# EAGLE design expansionboard (EAGLE 7.5.0)

## Sheet 1 of 5: output interfaces
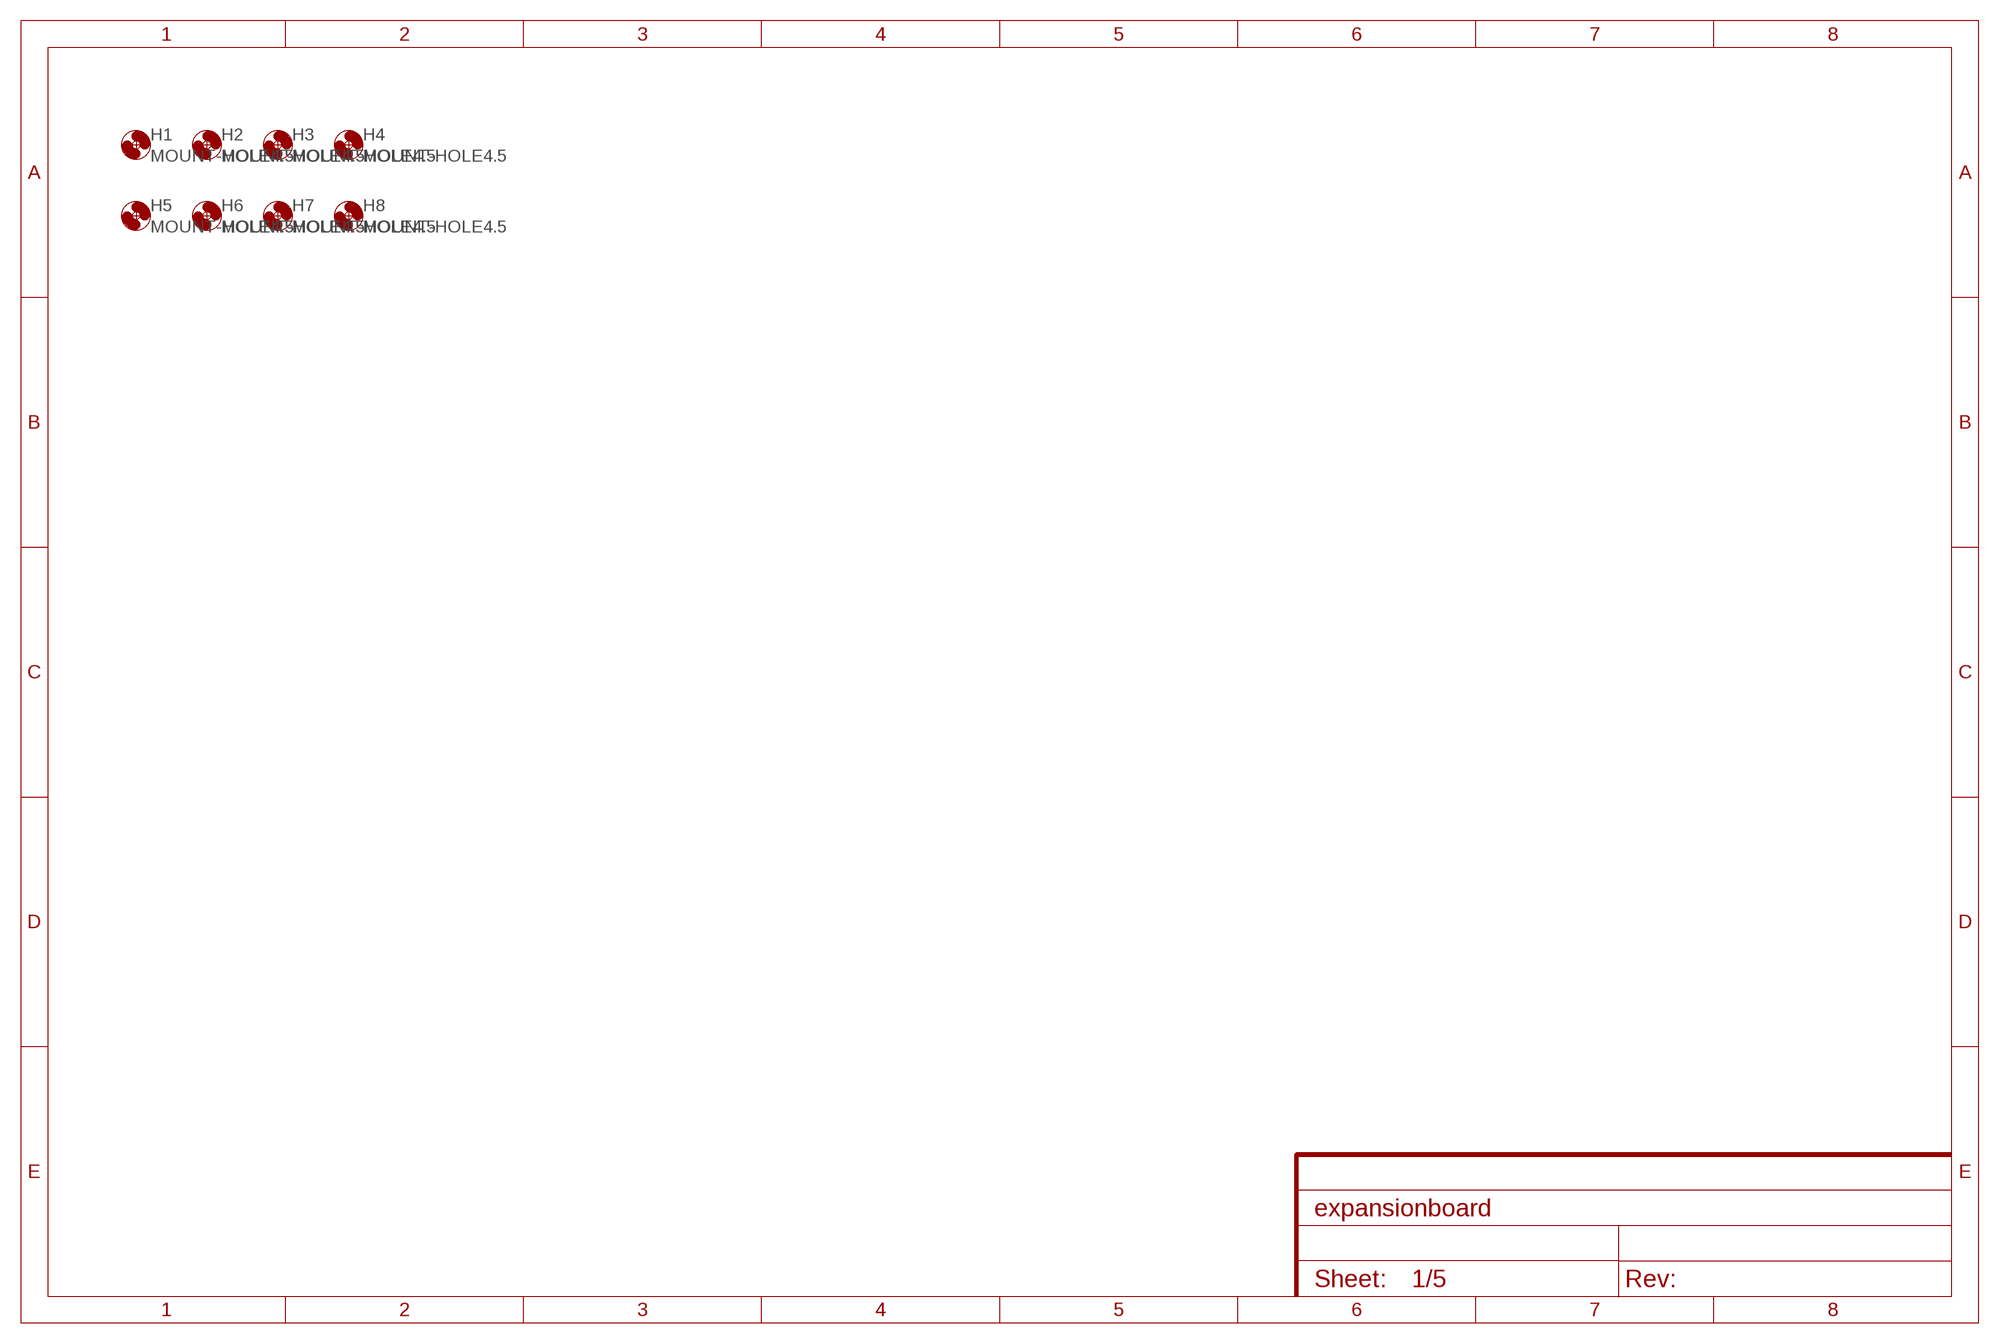
[diagram p0: schematic, sheet 1]

### Parts
H1  MOUNT-HOLE4.5  [4,5]
H2  MOUNT-HOLE4.5  [4,5]
H3  MOUNT-HOLE4.5  [4,5]
H4  MOUNT-HOLE4.5  [4,5]
H5  MOUNT-HOLE4.5  [4,5]
H6  MOUNT-HOLE4.5  [4,5]
H7  MOUNT-HOLE4.5  [4,5]
H8  MOUNT-HOLE4.5  [4,5]

## Sheet 2 of 5: Power Regulation
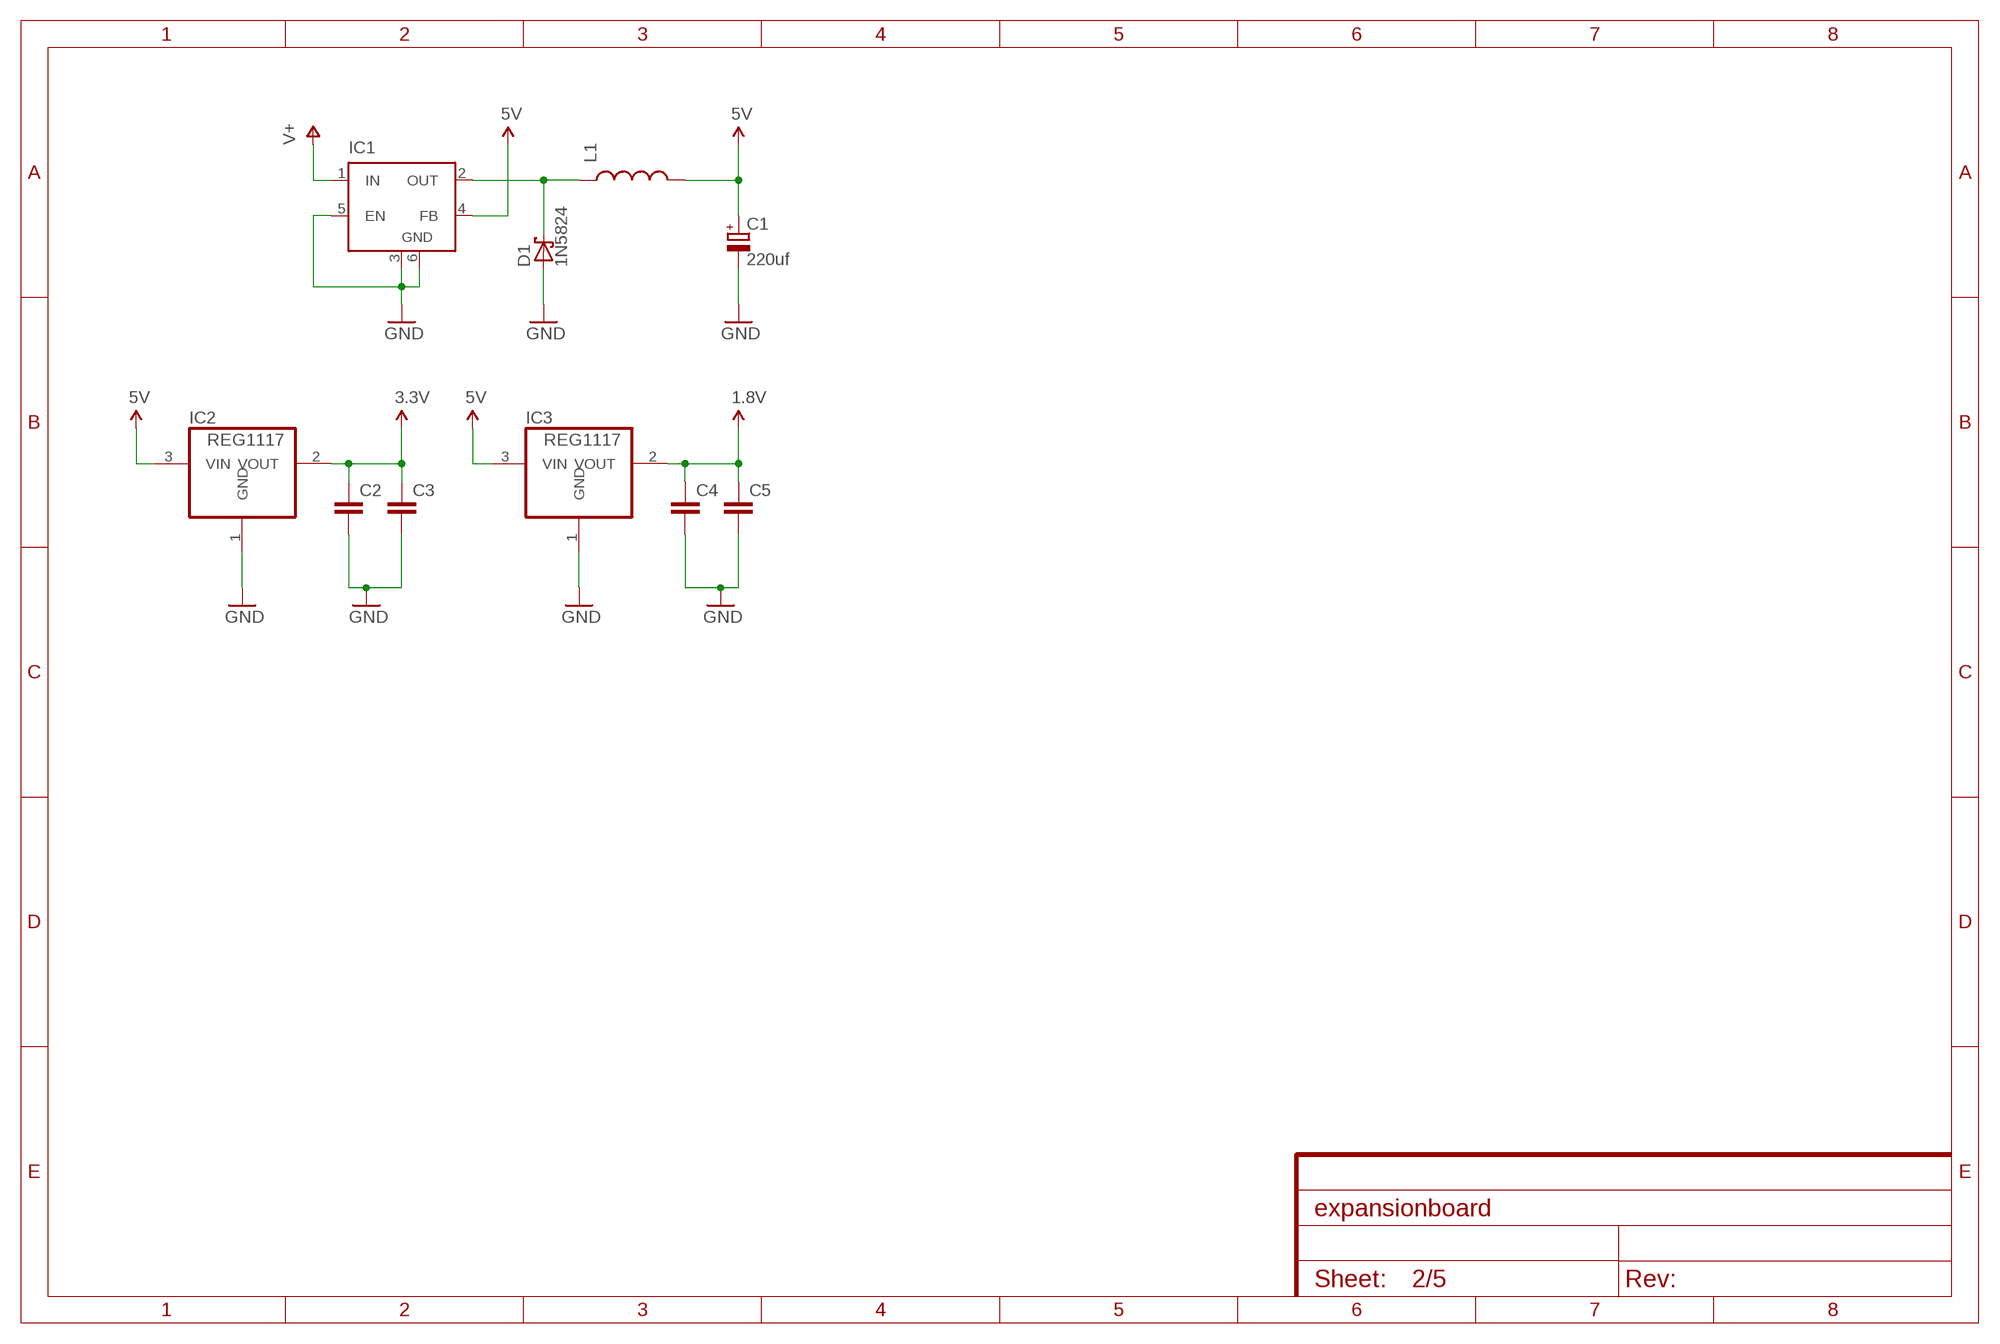
[diagram p1: schematic, sheet 2]

### Parts
C1  220uf  CPOL-EUE2.5-6  [E2,5-6]
C2  CAP1206  [1206]
C3  CAP1206  [1206]
C4  CAP1206  [1206]
C5  CAP1206  [1206]
D1  1N5824  1N5817-B  [DO41-7.6]
IC1  LM2596S  [TO263-5]
IC2  REG1117  [SOT223]
IC3  REG1117  [SOT223]
L1  INDUCTORSRU1038  [SRU1038]

### Nets
1.8V: C4.1 C5.1 IC3.2(VOUT)
3.3V: C2.1 C3.1 IC2.2(VOUT) ; also sheet 4
5V: C1.+ IC1.4(FB) IC2.3(VIN) IC3.3(VIN) L1.2 ; also sheet 5
GND: C1.- C2.2 C3.2 C4.2 C5.2 D1.A IC1.3(GND) IC1.5(EN) IC1.6(GND) IC2.1(GND) IC3.1(GND) ; also sheet 3,4,5
V+: IC1.1(IN) ; also sheet 3,5
VOUT: D1.C IC1.2(OUT) L1.1

## Sheet 3 of 5
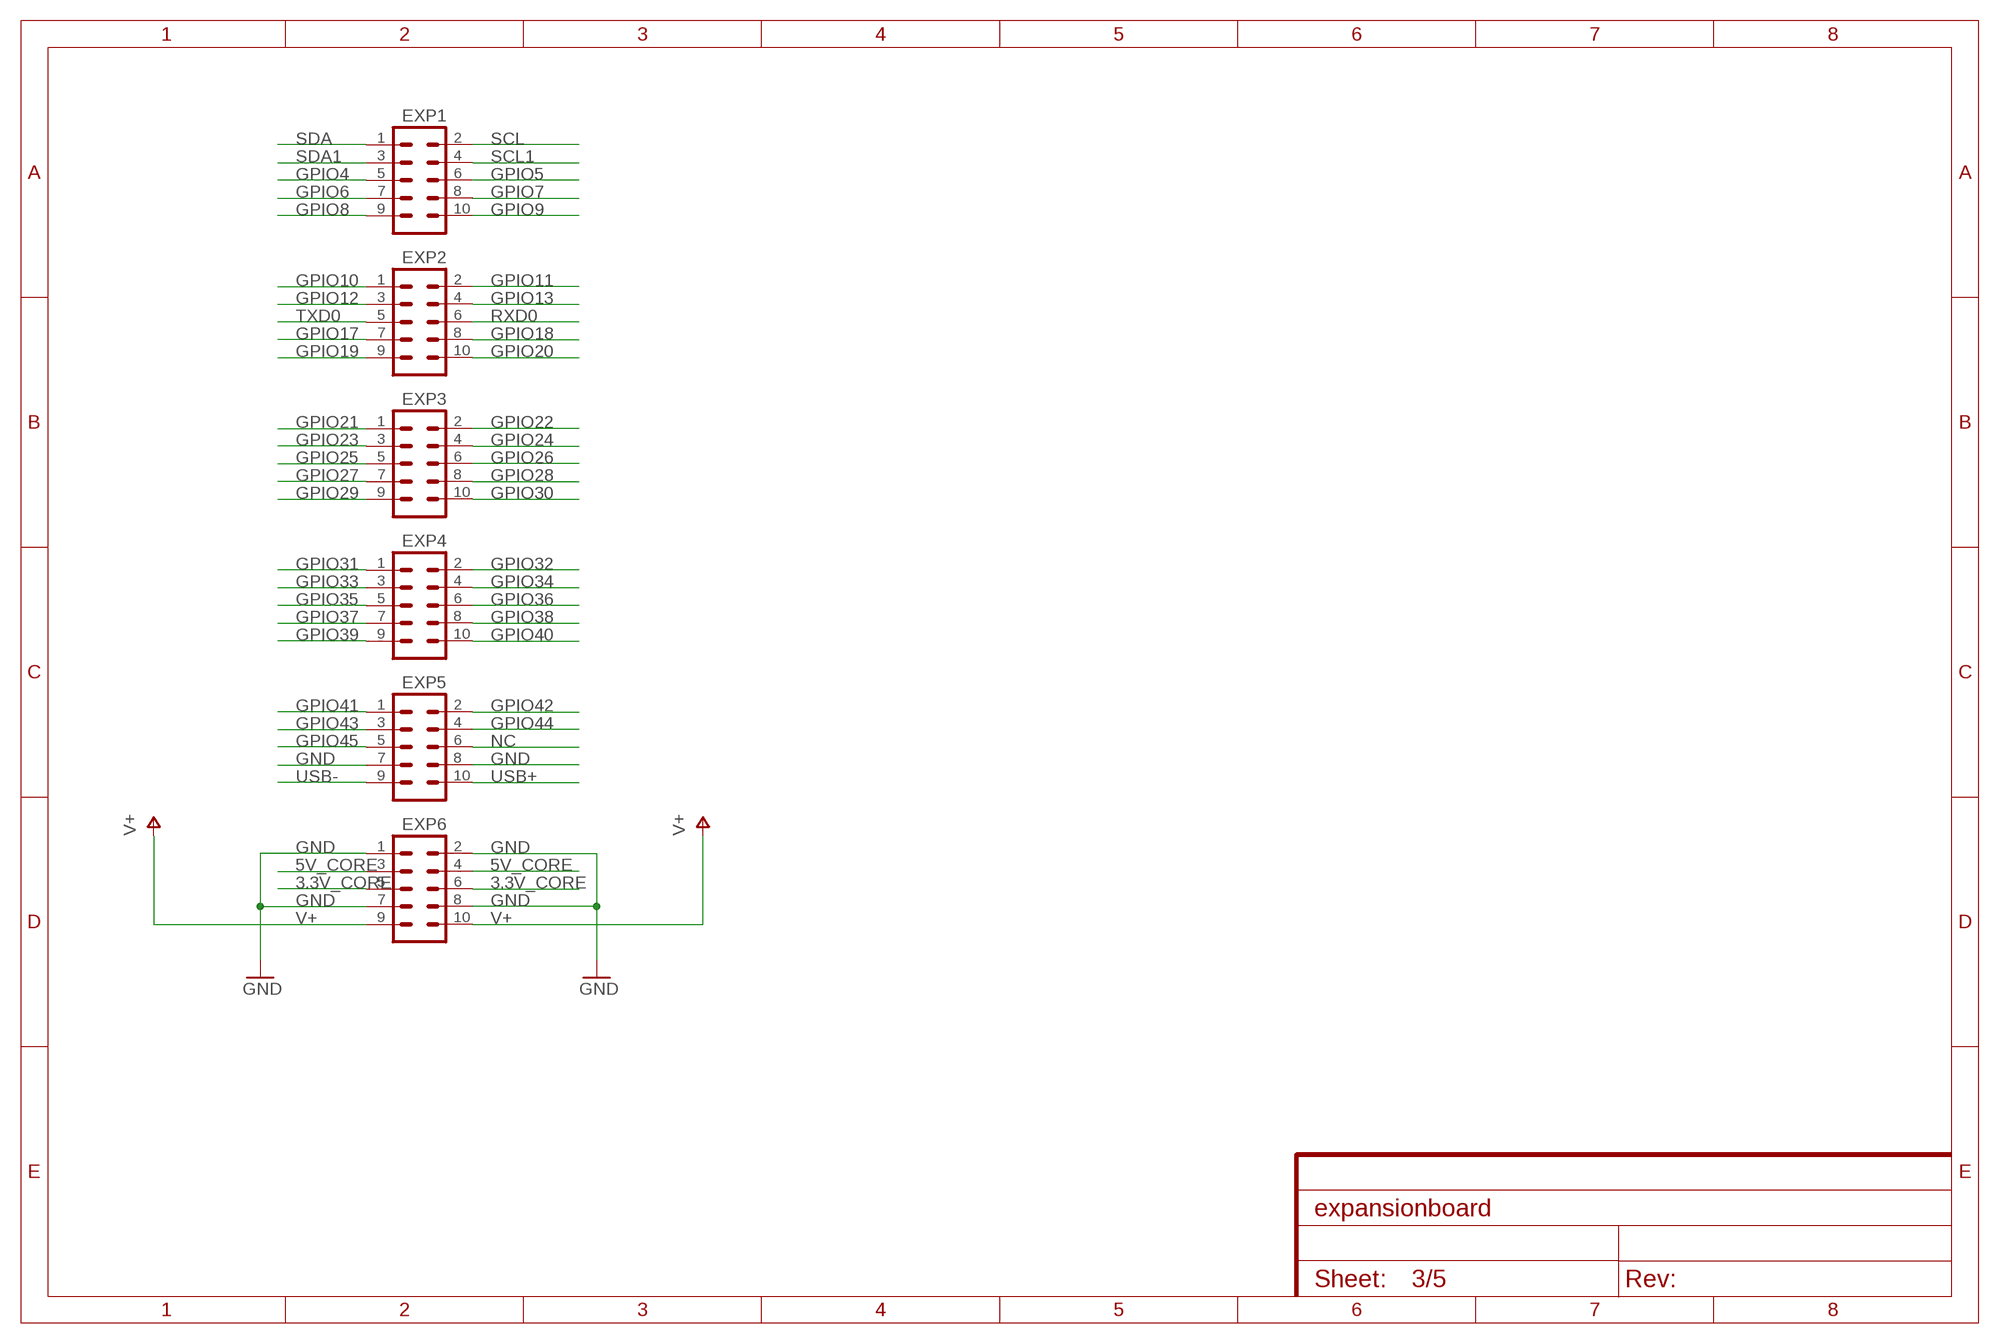
[diagram p2: schematic, sheet 3]

### Parts
EXP1  M05X2SHD_LOCK  [2X5-SHROUDED_LOCK]
EXP2  M05X2SHD_LOCK  [2X5-SHROUDED_LOCK]
EXP3  M05X2SHD_LOCK  [2X5-SHROUDED_LOCK]
EXP4  M05X2SHD_LOCK  [2X5-SHROUDED_LOCK]
EXP5  M05X2SHD_LOCK  [2X5-SHROUDED_LOCK]
EXP6  M05X2SHD_LOCK  [2X5-SHROUDED_LOCK]

### Nets
3.3V_CORE: EXP6.5 EXP6.6
5V_CORE: EXP6.3 EXP6.4
GND: EXP5.7 EXP5.8 EXP6.1 EXP6.2 EXP6.7 EXP6.8 ; also sheet 2,4,5
GPIO4: EXP1.5 ; also sheet 5
GPIO5: EXP1.6 ; also sheet 5
GPIO6: EXP1.7 ; also sheet 5
GPIO7: EXP1.8 ; also sheet 5
GPIO8: EXP1.9 ; also sheet 5
GPIO9: EXP1.10 ; also sheet 5
GPIO10: EXP2.1 ; also sheet 5
GPIO11: EXP2.2 ; also sheet 5
GPIO12: EXP2.3 ; also sheet 5
GPIO13: EXP2.4 ; also sheet 5
GPIO17: EXP2.7 ; also sheet 5
GPIO18: EXP2.8 ; also sheet 5
GPIO19: EXP2.9 ; also sheet 5
GPIO20: EXP2.10 ; also sheet 5
GPIO21: EXP3.1 ; also sheet 5
GPIO22: EXP3.2 ; also sheet 5
GPIO23: EXP3.3 ; also sheet 5
GPIO24: EXP3.4 ; also sheet 5
GPIO25: EXP3.5 ; also sheet 5
GPIO26: EXP3.6 ; also sheet 5
GPIO27: EXP3.7 ; also sheet 5
GPIO28: EXP3.8 ; also sheet 5
GPIO29: EXP3.9 ; also sheet 5
GPIO30: EXP3.10 ; also sheet 5
GPIO31: EXP4.1 ; also sheet 5
GPIO32: EXP4.2 ; also sheet 5
GPIO33: EXP4.3 ; also sheet 5
GPIO34: EXP4.4 ; also sheet 5
GPIO35: EXP4.5 ; also sheet 5
GPIO36: EXP4.6 ; also sheet 5
GPIO37: EXP4.7 ; also sheet 5
GPIO38: EXP4.8 ; also sheet 5
GPIO39: EXP4.9 ; also sheet 5
GPIO40: EXP4.10 ; also sheet 5
GPIO41: EXP5.1 ; also sheet 5
GPIO42: EXP5.2 ; also sheet 5
GPIO43: EXP5.3 ; also sheet 5
GPIO44: EXP5.4 ; also sheet 5
GPIO45: EXP5.5 ; also sheet 5
NC: EXP5.6
RXD0: EXP2.6 ; also sheet 5
SCL: EXP1.2 ; also sheet 5
SCL1: EXP1.4 ; also sheet 5
SDA: EXP1.1 ; also sheet 5
SDA1: EXP1.3 ; also sheet 5
TXD0: EXP2.5 ; also sheet 5
USB+: EXP5.10 ; also sheet 4
USB-: EXP5.9 ; also sheet 4
V+: EXP6.9 EXP6.10 ; also sheet 2,5

## Sheet 4 of 5
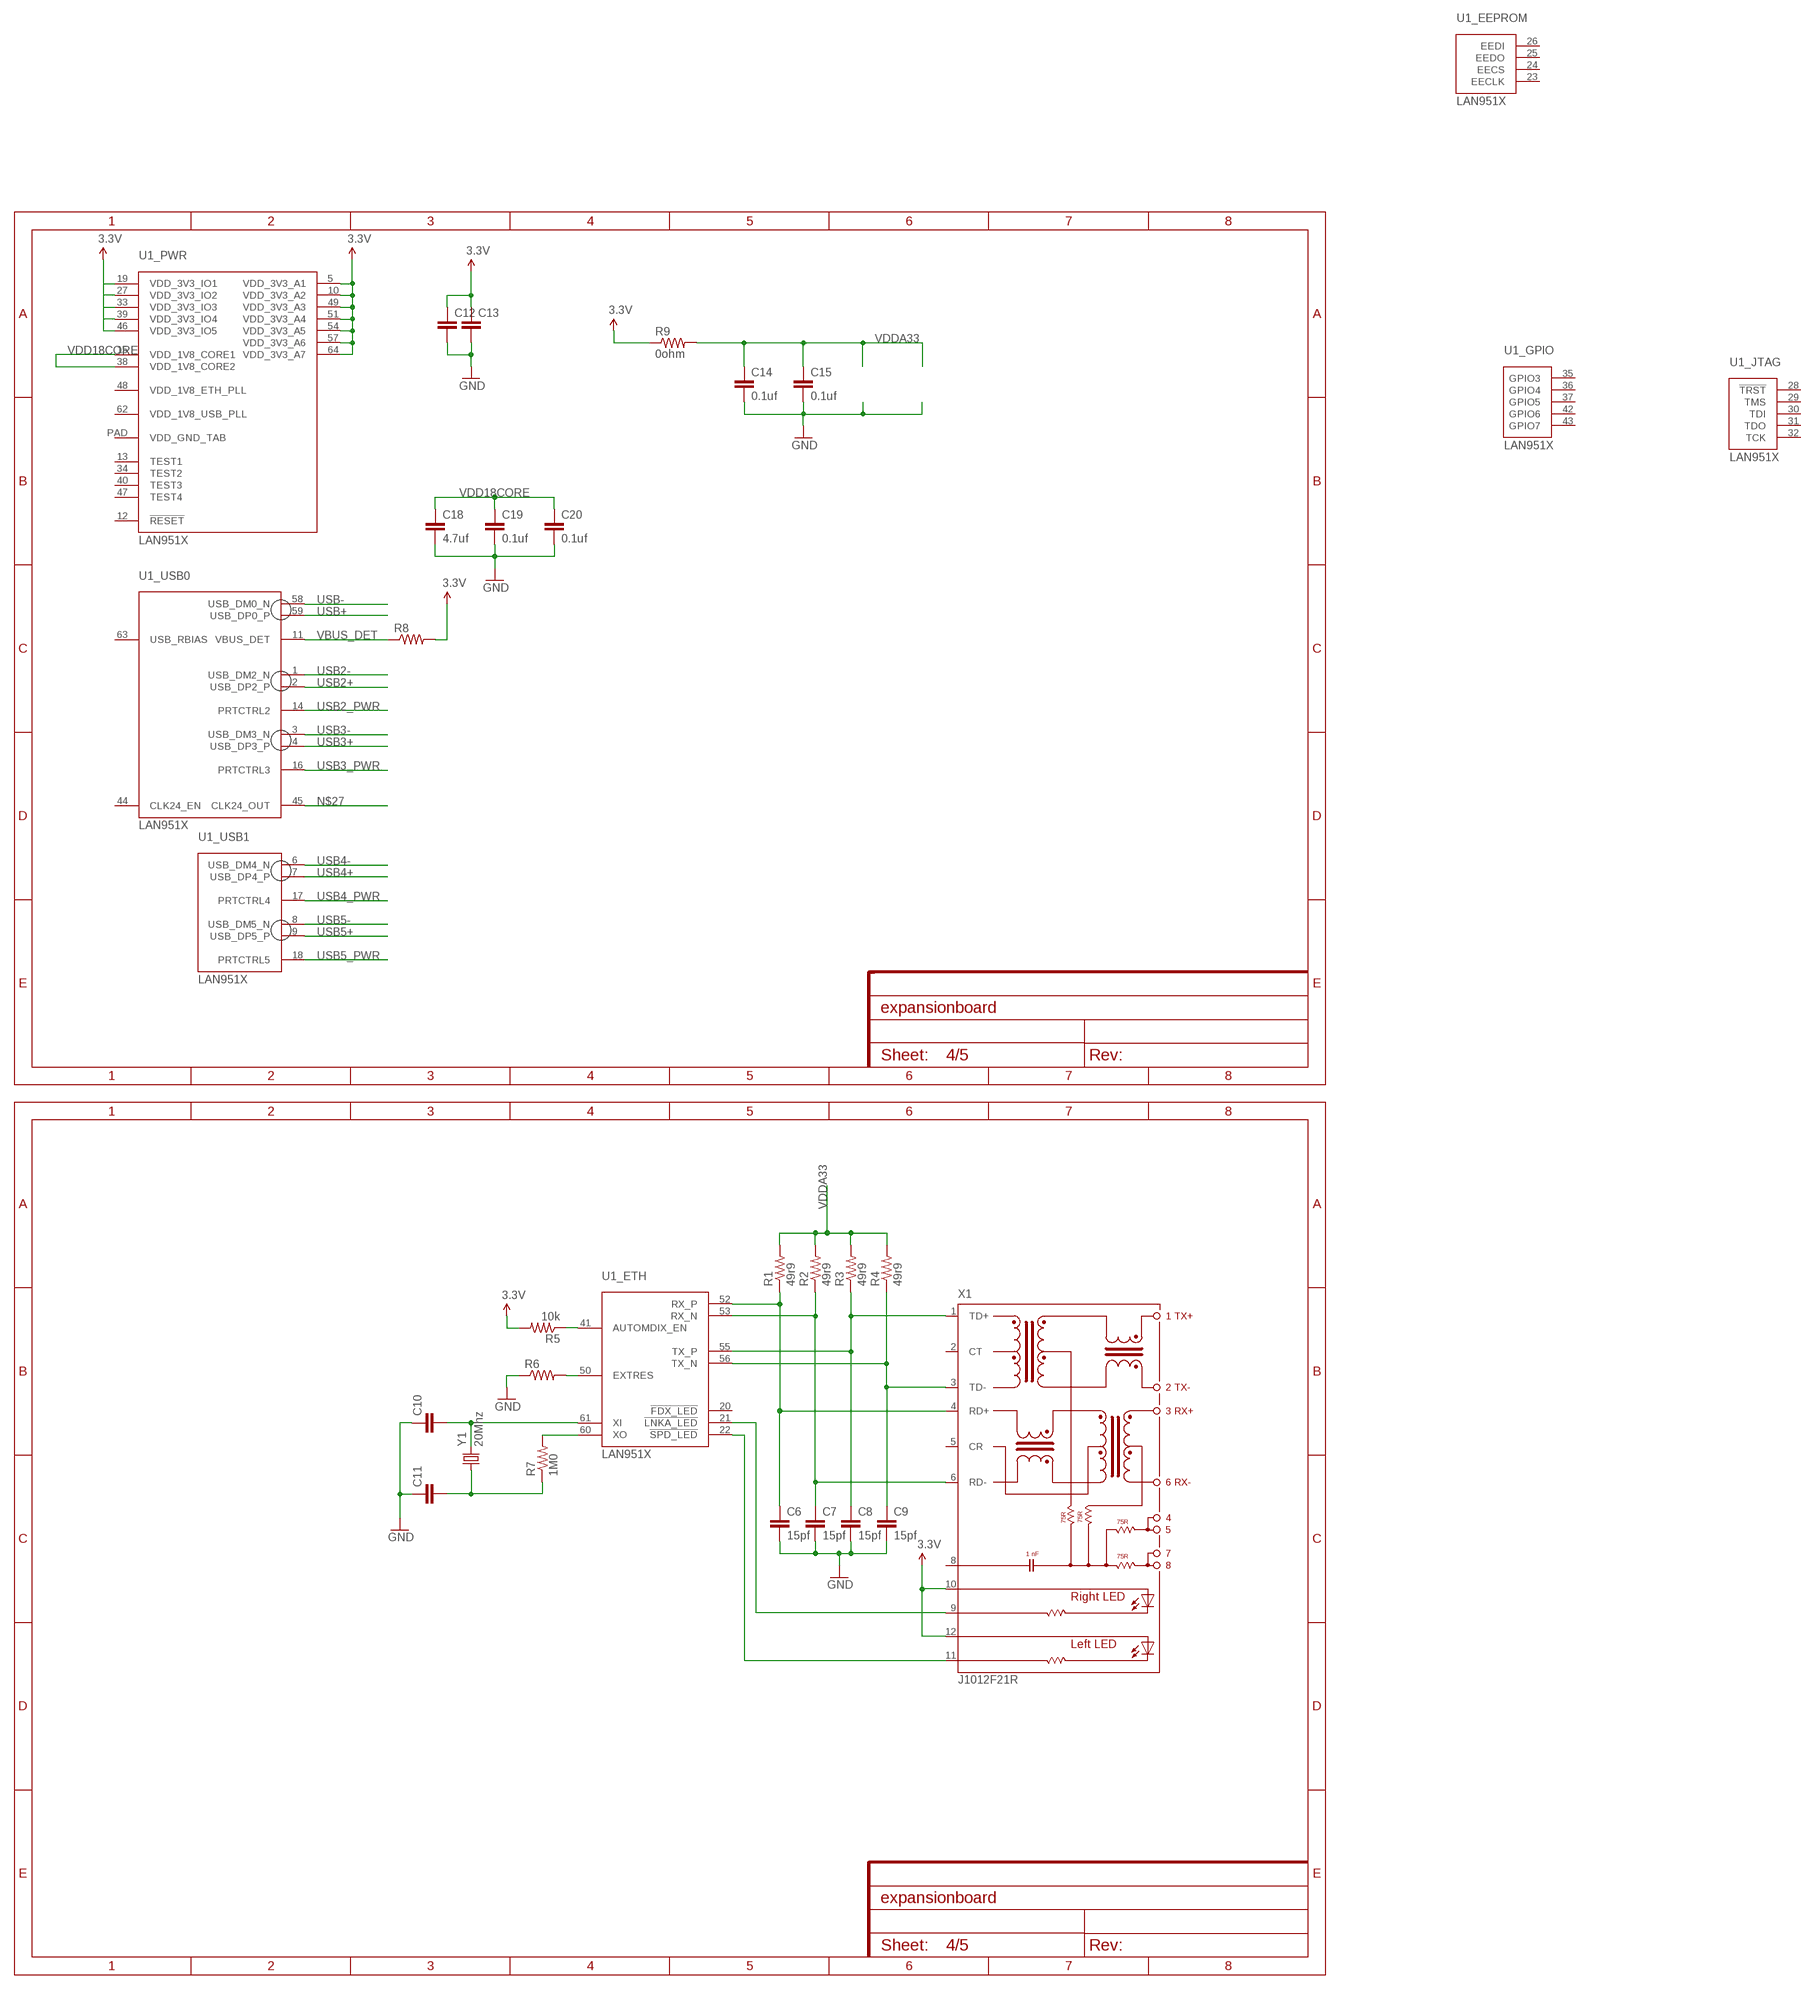
[diagram p3: schematic, sheet 4]

### Parts
C6  15pf  CAPEZ  [CAP-PTH-SMALLEZ]
C7  15pf  CAPEZ  [CAP-PTH-SMALLEZ]
C8  15pf  CAPEZ  [CAP-PTH-SMALLEZ]
C9  15pf  CAPEZ  [CAP-PTH-SMALLEZ]
C10  CAPEZ  [CAP-PTH-SMALLEZ]
C11  CAPEZ  [CAP-PTH-SMALLEZ]
C12  CAPEZ  [CAP-PTH-SMALLEZ]
C13  CAPEZ  [CAP-PTH-SMALLEZ]
C14  0.1uf  CAP1206  [1206]
C15  0.1uf  CAP1206  [1206]
C18  4.7uf  CAP1206  [1206]
C19  0.1uf  CAP1206  [1206]
C20  0.1uf  CAP1206  [1206]
R1  49r9  RESISTOREZ  [AXIAL-0.3EZ]
R2  49r9  RESISTOREZ  [AXIAL-0.3EZ]
R3  49r9  RESISTOREZ  [AXIAL-0.3EZ]
R4  49r9  RESISTOREZ  [AXIAL-0.3EZ]
R5  10k  RESISTOREZ  [AXIAL-0.3EZ]
R6  RESISTOREZ  [AXIAL-0.3EZ]
R7  1M0  RESISTOREZ  [AXIAL-0.3EZ]
R8  RESISTOR1206  [1206]
R9  0ohm  RESISTOR1206  [1206]
U1  LAN951X  [QFN-64]
X1  J1012F21R  [J1]
Y1  20Mhz  CRYSTALHC49US  [HC49US]

### Nets
3.3V: C12.1 C13.1 R5.P$2 R8.2 R9.1 U1.5(_PWR:VDD_3V3_A1) U1.10(_PWR:VDD_3V3_A2) U1.19(_PWR:VDD_3V3_IO1) U1.27(_PWR:VDD_3V3_IO2) U1.33(_PWR:VDD_3V3_IO3) U1.39(_PWR:VDD_3V3_IO4) U1.46(_PWR:VDD_3V3_IO5) U1.49(_PWR:VDD_3V3_A3) U1.51(_PWR:VDD_3V3_A4) U1.54(_PWR:VDD_3V3_A5) U1.57(_PWR:VDD_3V3_A6) U1.64(_PWR:VDD_3V3_A7) X1.10(A-R) X1.12(A-L) ; also sheet 2
GND: C6.2 C7.2 C8.2 C9.2 C10.1 C11.1 C12.2 C13.2 C14.2 C15.2 C18.2 C19.2 C20.2 R6.P$1 ; also sheet 2,3,5
N$1: C6.1 R1.P$1 U1.52(_ETH:RX_P) X1.4(RD+)
N$2: C7.1 R2.P$1 U1.53(_ETH:RX_N) X1.6(RD-)
N$3: C8.1 R3.P$1 U1.55(_ETH:TX_P) X1.1(TD+)
N$4: C9.1 R4.P$1 U1.56(_ETH:TX_N) X1.3(TD-)
N$7: U1.21(_ETH:!LNKA_LED) X1.9(C-R)
N$8: U1.22(_ETH:!SPD_LED) X1.11(C-L)
N$9: R5.P$1 U1.41(_ETH:AUTOMDIX_EN)
N$10: R6.P$2 U1.50(_ETH:EXTRES)
N$11: C10.2 U1.61(_ETH:XI) Y1.2
N$12: C11.2 R7.P$1 Y1.1
N$14: R7.P$2 U1.60(_ETH:XO)
N$27: U1.45(_USB0:CLK24_OUT)
USB2+: U1.2(_USB0:USB_DP2_P) ; also sheet 5
USB2-: U1.1(_USB0:USB_DM2_N) ; also sheet 5
USB2_PWR: U1.14(_USB0:PRTCTRL2) ; also sheet 5
USB3+: U1.4(_USB0:USB_DP3_P) ; also sheet 5
USB3-: U1.3(_USB0:USB_DM3_N) ; also sheet 5
USB3_PWR: U1.16(_USB0:PRTCTRL3) ; also sheet 5
USB4+: U1.7(_USB1:USB_DP4_P) ; also sheet 5
USB4-: U1.6(_USB1:USB_DM4_N) ; also sheet 5
USB4_PWR: U1.17(_USB1:PRTCTRL4) ; also sheet 5
USB5+: U1.9(_USB1:USB_DP5_P) ; also sheet 5
USB5-: U1.8(_USB1:USB_DM5_N) ; also sheet 5
USB5_PWR: U1.18(_USB1:PRTCTRL5) ; also sheet 5
USB+: U1.59(_USB0:USB_DP0_P) ; also sheet 3
USB-: U1.58(_USB0:USB_DM0_N) ; also sheet 3
VBUS_DET: R8.1 U1.11(_USB0:VBUS_DET)
VDD18CORE: C18.1 C19.1 C20.1 U1.15(_PWR:VDD_1V8_CORE1) U1.38(_PWR:VDD_1V8_CORE2)
VDDA33: C14.1 C15.1 R1.P$2 R2.P$2 R3.P$2 R4.P$2 R9.2
Unconnected: U1.12(_PWR:!RESET) U1.13(_PWR:TEST1) U1.20(_ETH:!FDX_LED) U1.23(_EEPROM:EECLK) U1.24(_EEPROM:EECS) U1.25(_EEPROM:EEDO) U1.26(_EEPROM:EEDI) U1.28(_JTAG:!TRST) U1.29(_JTAG:TMS) U1.30(_JTAG:TDI) U1.31(_JTAG:TDO) U1.32(_JTAG:TCK) U1.34(_PWR:TEST2) U1.35(_GPIO:GPIO3) U1.36(_GPIO:GPIO4) U1.37(_GPIO:GPIO5) U1.40(_PWR:TEST3) U1.42(_GPIO:GPIO6) U1.43(_GPIO:GPIO7) U1.44(_USB0:CLK24_EN) U1.47(_PWR:TEST4) U1.48(_PWR:VDD_1V8_ETH_PLL) U1.62(_PWR:VDD_1V8_USB_PLL) U1.63(_USB0:USB_RBIAS) U1.PAD(_PWR:VDD_GND_TAB) X1.2(CT) X1.5(CR) X1.8

## Sheet 5 of 5
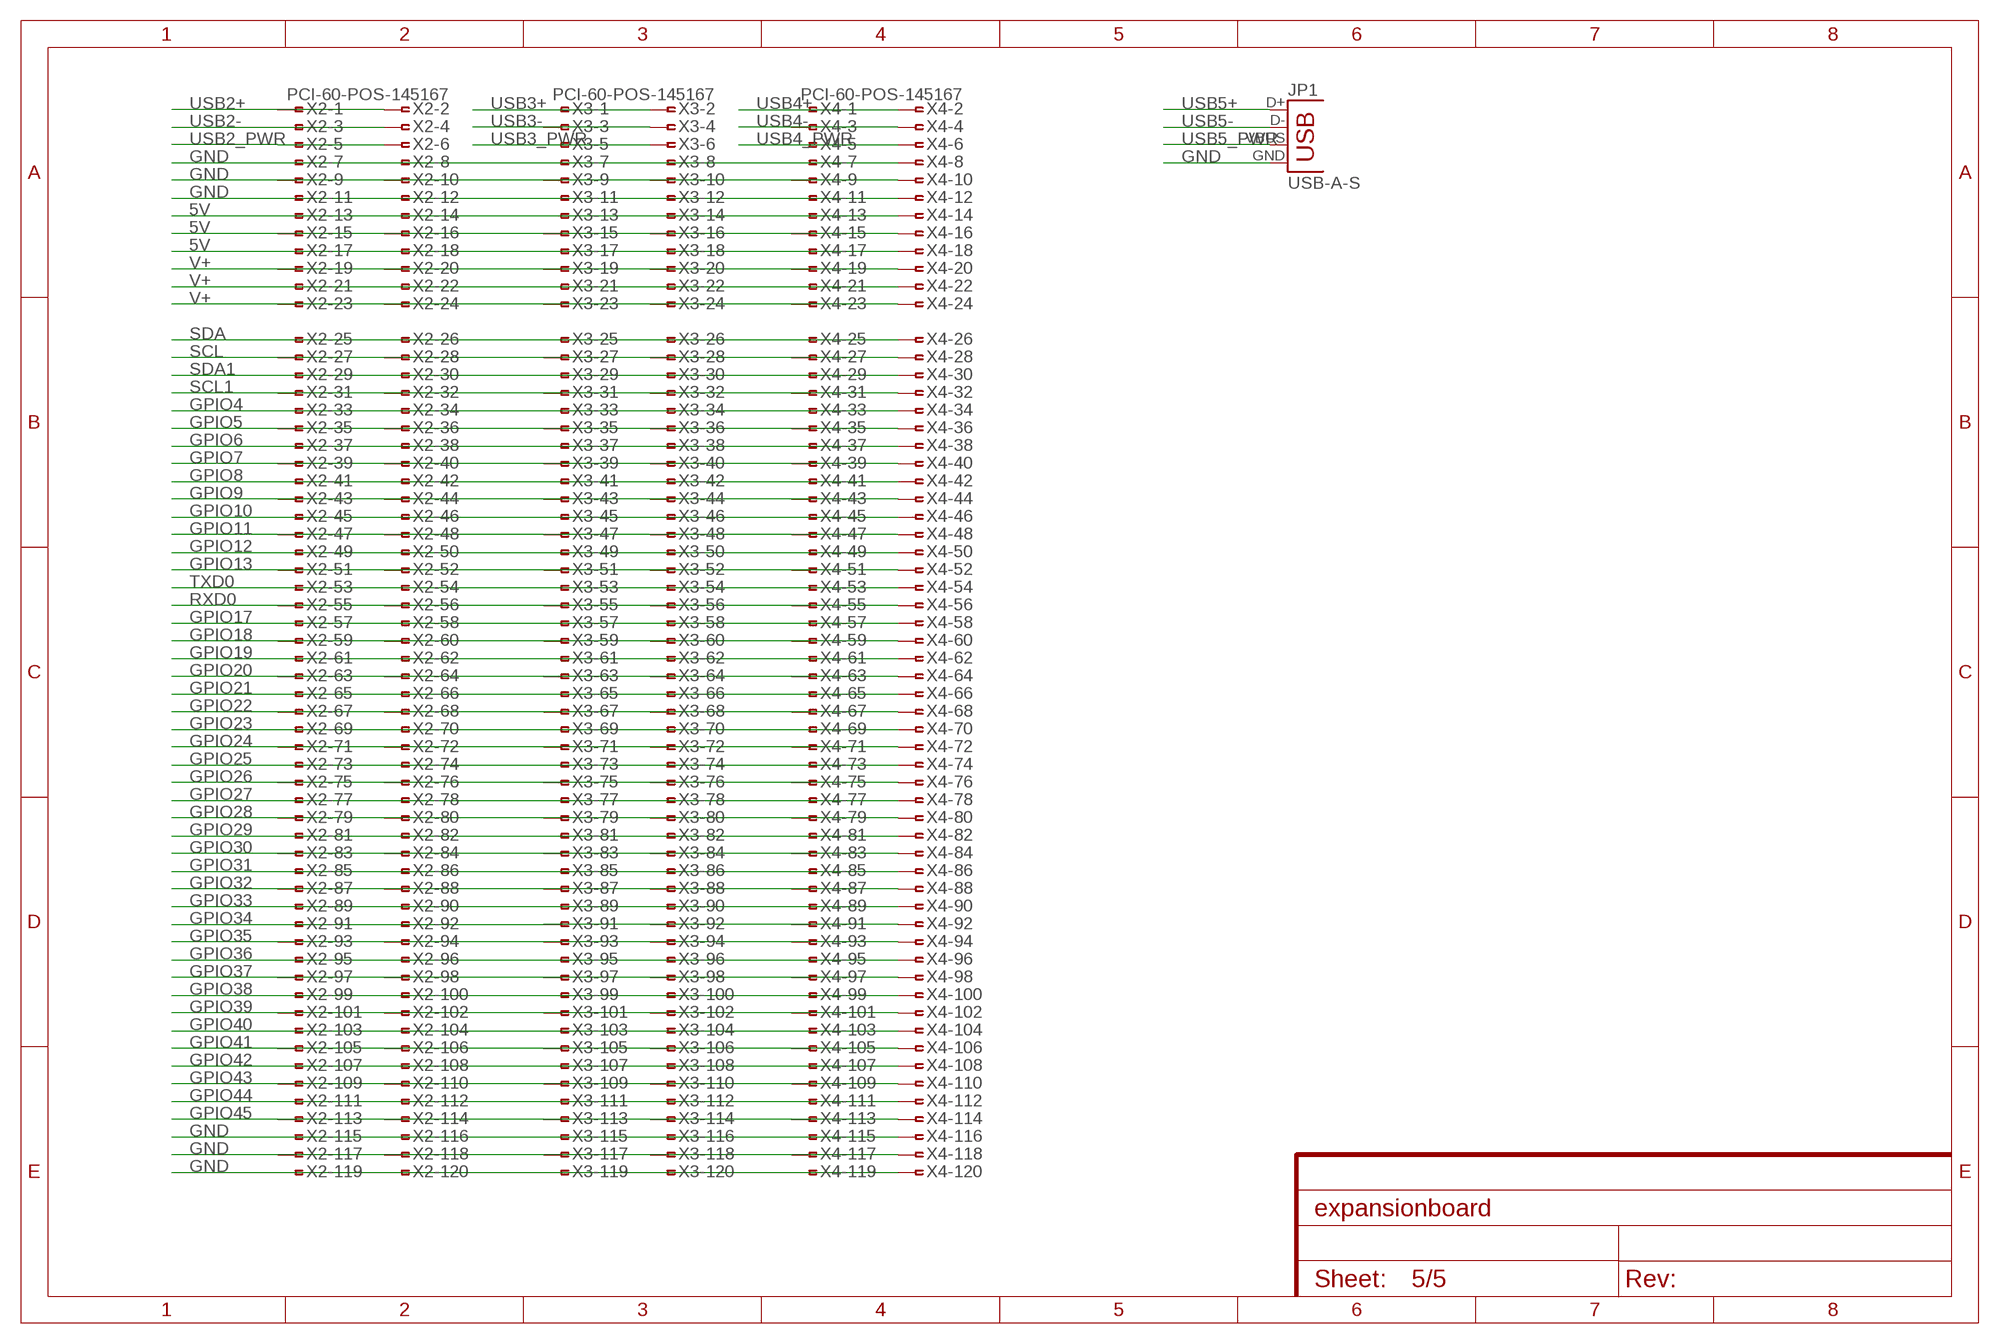
[diagram p4: schematic, sheet 5]

### Parts
JP1  USB-A-S  [USB-A-S]
X2  PCI-60-POS-145167  [145167-2]
X3  PCI-60-POS-145167  [145167-2]
X4  PCI-60-POS-145167  [145167-2]

### Nets
5V: X2.13 X2.14 X2.15 X2.16 X2.17 X2.18 X3.13 X3.14 X3.15 X3.16 X3.17 X3.18 X4.13 X4.14 X4.15 X4.16 X4.17 X4.18 ; also sheet 2
GND: JP1.GND X2.7 X2.8 X2.9 X2.10 X2.11 X2.12 X2.115 X2.116 X2.117 X2.118 X2.119 X2.120 X3.7 X3.8 X3.9 X3.10 X3.11 X3.12 X3.115 X3.116 X3.117 X3.118 X3.119 X3.120 X4.7 X4.8 X4.9 X4.10 X4.11 X4.12 X4.115 X4.116 X4.117 X4.118 X4.119 X4.120 ; also sheet 2,3,4
GPIO4: X2.33 X2.34 X3.33 X3.34 X4.33 X4.34 ; also sheet 3
GPIO5: X2.35 X2.36 X3.35 X3.36 X4.35 X4.36 ; also sheet 3
GPIO6: X2.37 X2.38 X3.37 X3.38 X4.37 X4.38 ; also sheet 3
GPIO7: X2.39 X2.40 X3.39 X3.40 X4.39 X4.40 ; also sheet 3
GPIO8: X2.41 X2.42 X3.41 X3.42 X4.41 X4.42 ; also sheet 3
GPIO9: X2.43 X2.44 X3.43 X3.44 X4.43 X4.44 ; also sheet 3
GPIO10: X2.45 X2.46 X3.45 X3.46 X4.45 X4.46 ; also sheet 3
GPIO11: X2.47 X2.48 X3.47 X3.48 X4.47 X4.48 ; also sheet 3
GPIO12: X2.49 X2.50 X3.49 X3.50 X4.49 X4.50 ; also sheet 3
GPIO13: X2.51 X2.52 X3.51 X3.52 X4.51 X4.52 ; also sheet 3
GPIO17: X2.57 X2.58 X3.57 X3.58 X4.57 X4.58 ; also sheet 3
GPIO18: X2.59 X2.60 X3.59 X3.60 X4.59 X4.60 ; also sheet 3
GPIO19: X2.61 X2.62 X3.61 X3.62 X4.61 X4.62 ; also sheet 3
GPIO20: X2.63 X2.64 X3.63 X3.64 X4.63 X4.64 ; also sheet 3
GPIO21: X2.65 X2.66 X3.65 X3.66 X4.65 X4.66 ; also sheet 3
GPIO22: X2.67 X2.68 X3.67 X3.68 X4.67 X4.68 ; also sheet 3
GPIO23: X2.69 X2.70 X3.69 X3.70 X4.69 X4.70 ; also sheet 3
GPIO24: X2.71 X2.72 X3.71 X3.72 X4.71 X4.72 ; also sheet 3
GPIO25: X2.73 X2.74 X3.73 X3.74 X4.73 X4.74 ; also sheet 3
GPIO26: X2.75 X2.76 X3.75 X3.76 X4.75 X4.76 ; also sheet 3
GPIO27: X2.77 X2.78 X3.77 X3.78 X4.77 X4.78 ; also sheet 3
GPIO28: X2.79 X2.80 X3.79 X3.80 X4.79 X4.80 ; also sheet 3
GPIO29: X2.81 X2.82 X3.81 X3.82 X4.81 X4.82 ; also sheet 3
GPIO30: X2.83 X2.84 X3.83 X3.84 X4.83 X4.84 ; also sheet 3
GPIO31: X2.85 X2.86 X3.85 X3.86 X4.85 X4.86 ; also sheet 3
GPIO32: X2.87 X2.88 X3.87 X3.88 X4.87 X4.88 ; also sheet 3
GPIO33: X2.89 X2.90 X3.89 X3.90 X4.89 X4.90 ; also sheet 3
GPIO34: X2.91 X2.92 X3.91 X3.92 X4.91 X4.92 ; also sheet 3
GPIO35: X2.93 X2.94 X3.93 X3.94 X4.93 X4.94 ; also sheet 3
GPIO36: X2.95 X2.96 X3.95 X3.96 X4.95 X4.96 ; also sheet 3
GPIO37: X2.97 X2.98 X3.97 X3.98 X4.97 X4.98 ; also sheet 3
GPIO38: X2.99 X2.100 X3.99 X3.100 X4.99 X4.100 ; also sheet 3
GPIO39: X2.101 X2.102 X3.101 X3.102 X4.101 X4.102 ; also sheet 3
GPIO40: X2.103 X2.104 X3.103 X3.104 X4.103 X4.104 ; also sheet 3
GPIO41: X2.105 X2.106 X3.105 X3.106 X4.105 X4.106 ; also sheet 3
GPIO42: X2.107 X2.108 X3.107 X3.108 X4.107 X4.108 ; also sheet 3
GPIO43: X2.109 X2.110 X3.109 X3.110 X4.109 X4.110 ; also sheet 3
GPIO44: X2.111 X2.112 X3.111 X3.112 X4.111 X4.112 ; also sheet 3
GPIO45: X2.113 X2.114 X3.113 X3.114 X4.113 X4.114 ; also sheet 3
RXD0: X2.55 X2.56 X3.55 X3.56 X4.55 X4.56 ; also sheet 3
SCL: X2.27 X2.28 X3.27 X3.28 X4.27 X4.28 ; also sheet 3
SCL1: X2.31 X2.32 X3.31 X3.32 X4.31 X4.32 ; also sheet 3
SDA: X2.25 X2.26 X3.25 X3.26 X4.25 X4.26 ; also sheet 3
SDA1: X2.29 X2.30 X3.29 X3.30 X4.29 X4.30 ; also sheet 3
TXD0: X2.53 X2.54 X3.53 X3.54 X4.53 X4.54 ; also sheet 3
USB2+: X2.1 X2.2 ; also sheet 4
USB2-: X2.3 X2.4 ; also sheet 4
USB2_PWR: X2.5 X2.6 ; also sheet 4
USB3+: X3.1 X3.2 ; also sheet 4
USB3-: X3.3 X3.4 ; also sheet 4
USB3_PWR: X3.5 X3.6 ; also sheet 4
USB4+: X4.1 X4.2 ; also sheet 4
USB4-: X4.3 X4.4 ; also sheet 4
USB4_PWR: X4.5 X4.6 ; also sheet 4
USB5+: JP1.D+ ; also sheet 4
USB5-: JP1.D- ; also sheet 4
USB5_PWR: JP1.VBUS ; also sheet 4
V+: X2.19 X2.20 X2.21 X2.22 X2.23 X2.24 X3.19 X3.20 X3.21 X3.22 X3.23 X3.24 X4.19 X4.20 X4.21 X4.22 X4.23 X4.24 ; also sheet 2,3

## Library data of the parts
C1 = rcl:CPOL-EU: POLARIZED CAPACITOR, European symbol
C2-C15 C18-C20 = SparkFun-Capacitors:CAP: Capacitor Standard 0603 ceramic capacitor, and 0.1" leaded capacitor.
D1 = diode:1N581*: 1.0A SCHOTTKY BARRIER RECTIFIER Source: http://www.diodes.com/datasheets/ds23001.pdf
EXP1-EXP6 = SparkFun-Connectors:M05X2: Header 5x2 Standard 10-pin dual row 0.1" header. Commonly used with AVR-ISP. Use with Spark Fun Electronics SKU: PRT-00778
H1-H8 = holes:MOUNT-HOLE: MOUNTING HOLE with drill center marker
IC1 = linear:LM2596S: STEP-DOWN VOLTAGE REGULATOR
IC2 IC3 = burr-brown:REG1117: 800mA and 1A Low Dropout (LDO) Positive Regulator 1.8V, 2.5V, 2.85V, 3.3V, 5V, and Adj; MPN: REG1117; OC_FARNELL: 1097566; OC_NEWARK: 14P6981
JP1 = SparkFun-Connectors:USB: USB Connectors USB-B-PTH is fully proven SKU : PRT-00139/CONN-08278 USB-miniB is fully proven SKU : PRT-00587 USB-A-PCB is untested. USB-A-H is throughly reviewed, but untested. Spark Fun Electronics SKU : PRT-00437 USB-B-SMT is throughly reviewed, but untested. Needs silkscreen touching up. USB-A-S has not been used/tested USB-MB-H has not been used/tested USB-MICROB has been used. CONN-09505
L1 = SparkFun-Passives:INDUCTOR: Inductors Basic Inductor/Choke - 0603 and 1206. Footprints are not proven and vary greatly between part numbers. SRN6045- 33uH, 20% 1.4A SDR0403-560KL - 56uH, 10%, 500mA RMS/740mA peak
R1-R9 = SparkFun-Resistors:RESISTOR: Resistor Basic schematic elements and footprints for 0603, 1206, and PTH resistors.
U1 = Ciseco%20Pi%20Compute%20Module:LAN951X: LAN951X LAN9512 has two downstream USB ports LAN9514 has four downstream USB ports The same footprint is use for both but for LAN9512 (2 port) accpications the _USB1 block signals should be NC
X1 = con-pulse:J1012F21R: PULSEJACK (TM) 1x1 Tab-UP RJ45 10/100 Base-TX RJ45 1x1 Tab-UP with LEDs 8-pin (J1 series) and 6-pin (JP series) integrated magnetics connector, designed to support applications, such as ADSL modems, LAN-on-Motherboard, and Hub and Switches. Source: www.pulseeng.com .. PulseJack-J402.pdf; OC_FARNELL: unknown; OC_NEWARK: unknown
X2-X4 = con-amp:PCI-60-POS: PCI-SLOT 60 Dual Position 0.05 Series Standard Edge Source: http://catalog.tycoelectronics.com .. ENG_CD_145167_F.pdf
Y1 = SparkFun-FreqCtrl:CRYSTAL: Various standard crystals. Proven footprints.

## Board
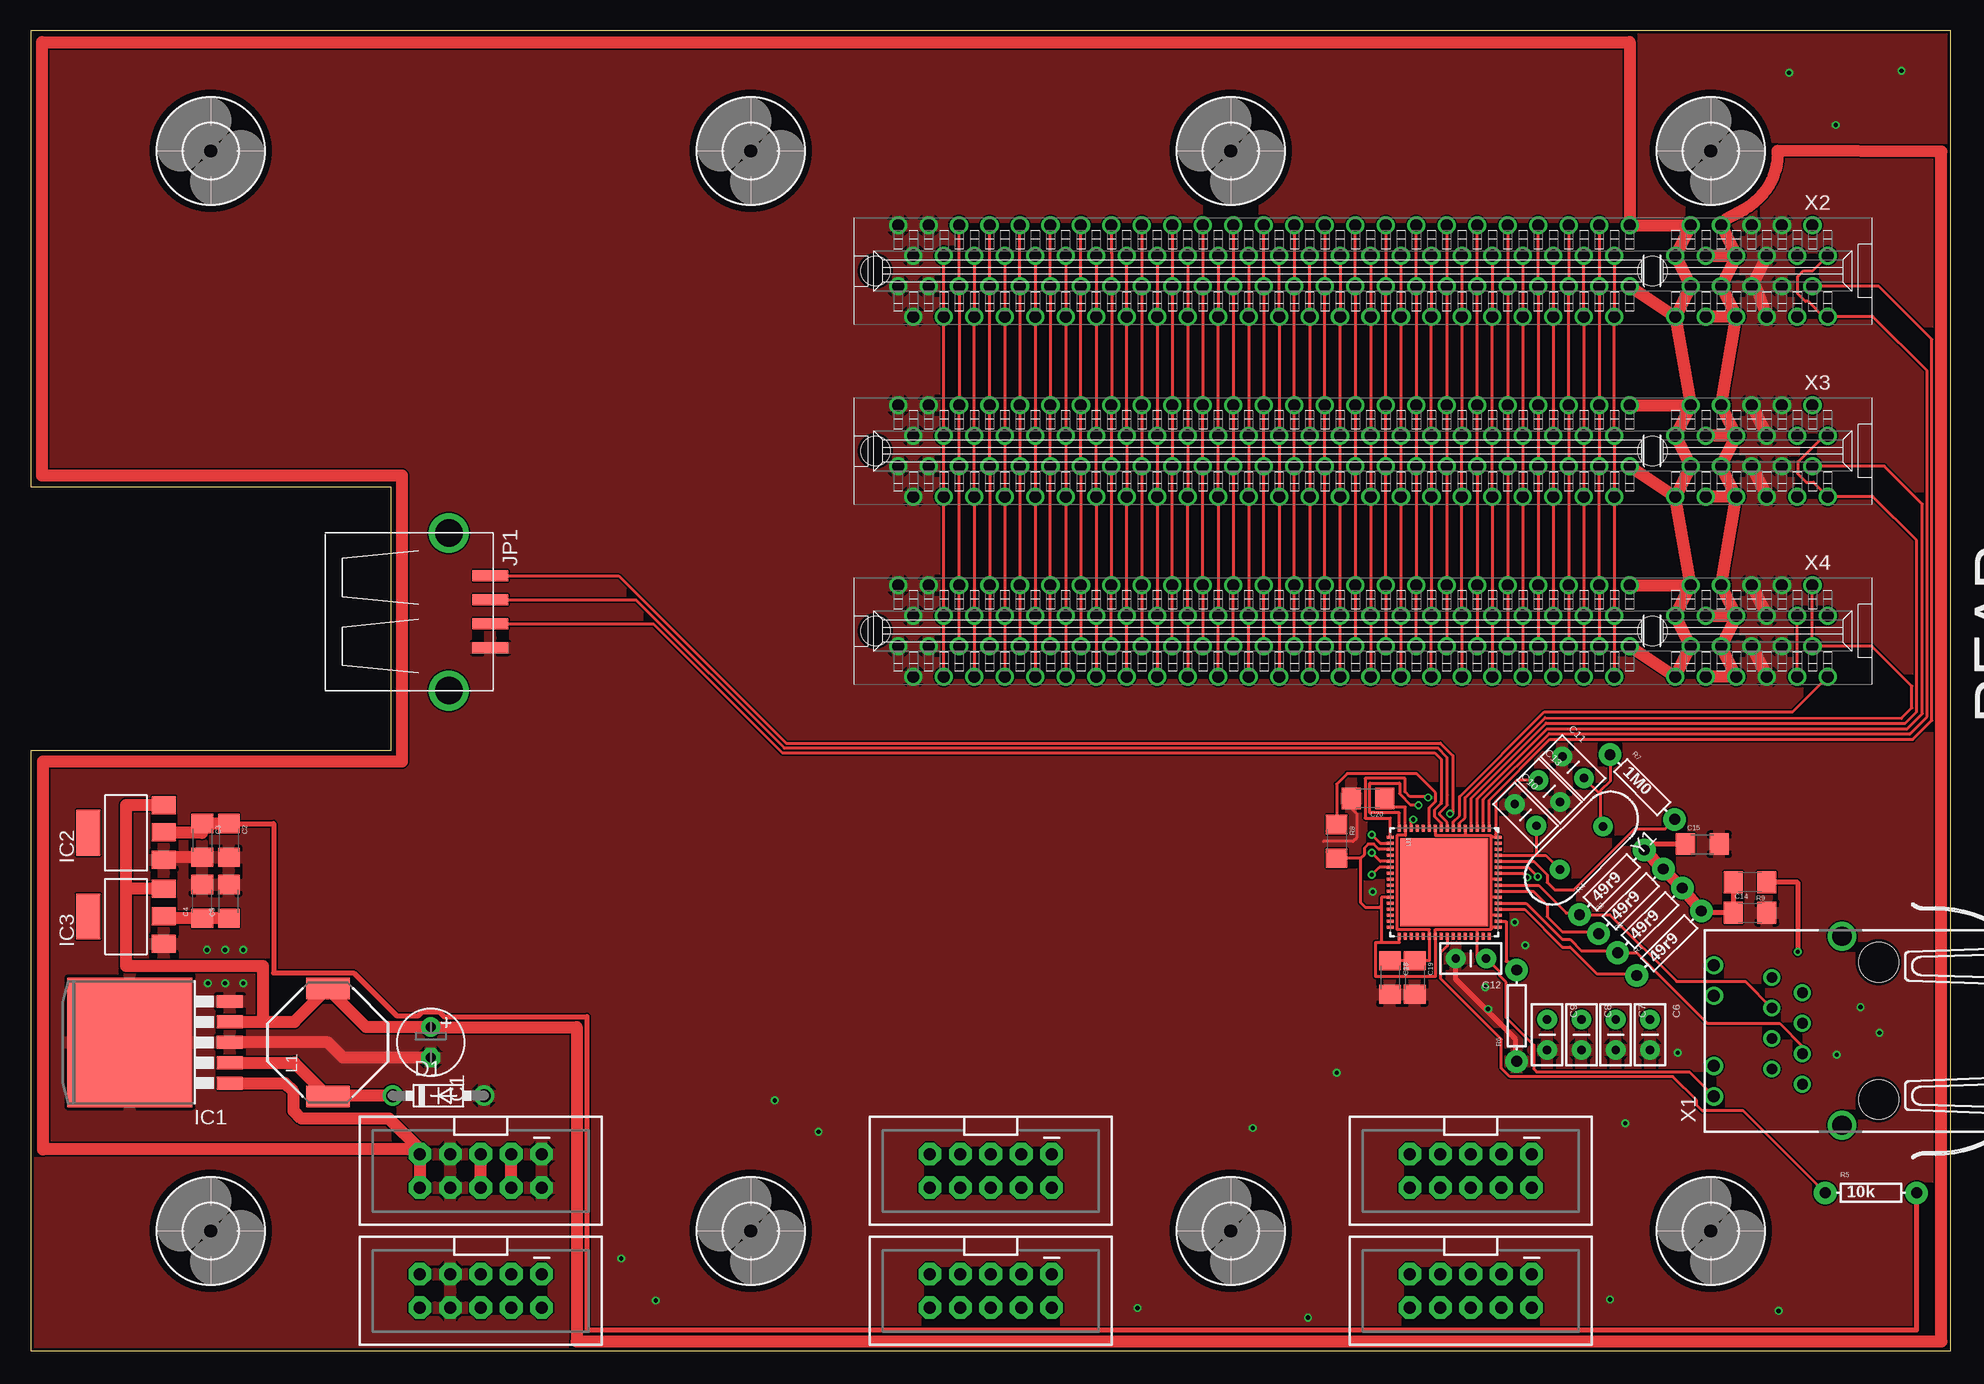
[diagram p5: board, top side]
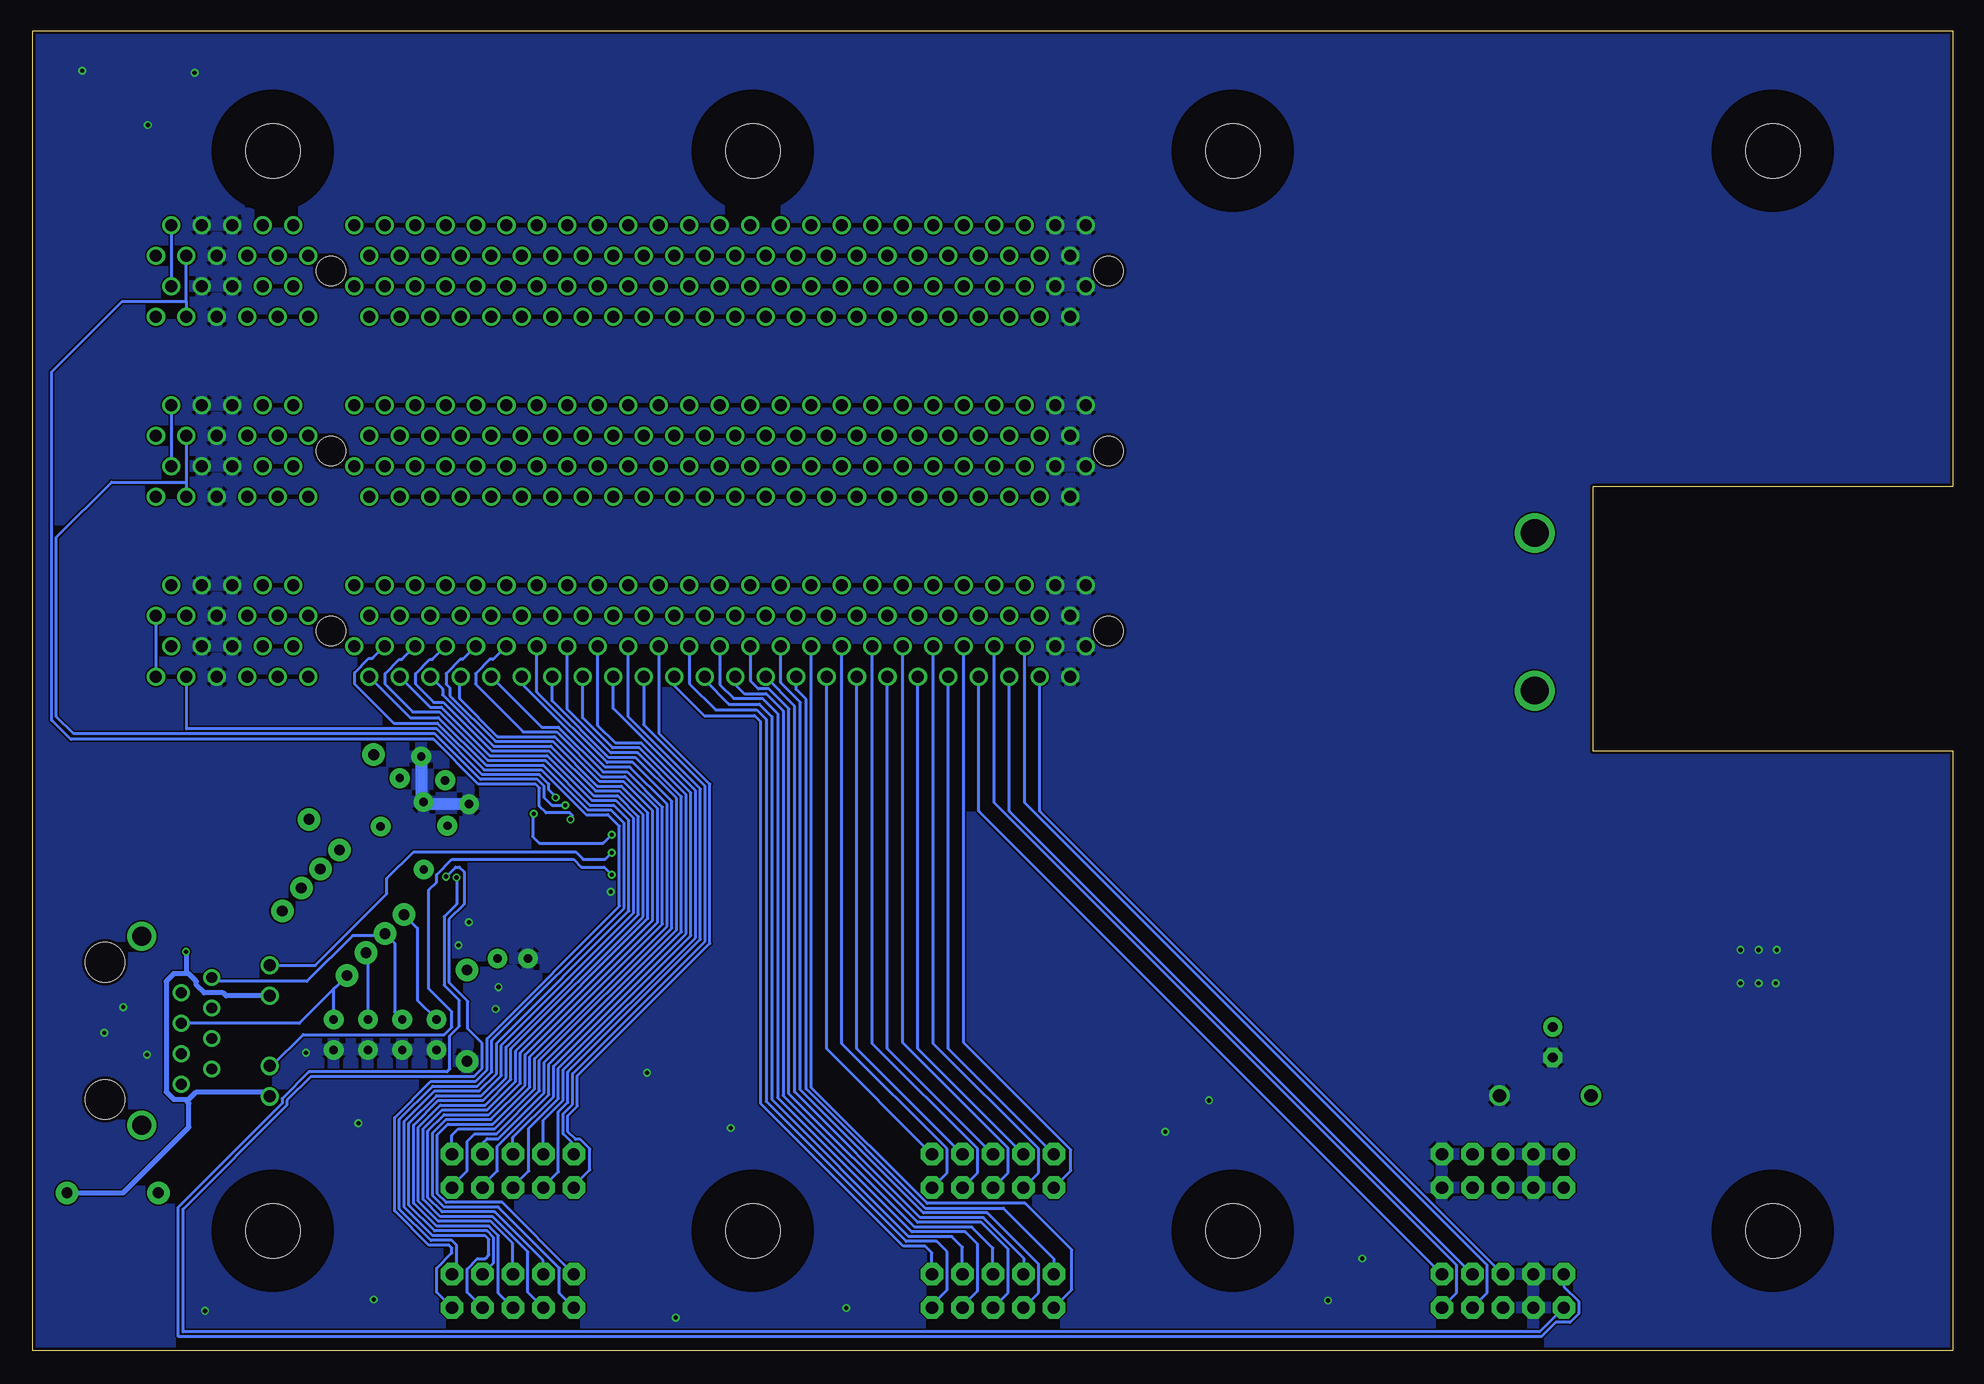
[diagram p6: board, bottom side, seen from below]

Size 160 x 110 mm. Coordinates in mm from the lower left corner, seen from the top.
Outline: 160,0 160,110 0,110 0,72 30,72 30,50 0,50 0,0 160,0
Copper layers (1*16): Top 0.035mm / dielectric 1.5mm / Bottom 0.035mm
Design rules "dirtypcbs": minimum track width 5mil, minimum drill 12mil, track to track 5mil, track to pad 5mil, pad to pad 5mil, via to via 5mil, smd to smd 0mil, copper to edge 10mil, drill to drill 10mil, minimum pad ring 10mil, minimum via ring 6mil, stop-mask expansion 2mil, vias tented up to drill 25mil, thermal gap 10mil

### Footprints (pad centres in the part's own frame; a part is rotated, then mirrored left to right if it is on the bottom)
E2,5-6 = drill 0.813 pad 1.6: + -1.27,0 | drill 0.813 pad 1.6 octagon: - 1.27,0
1206 = smd 1.6 x 1.8: 1 -1.4,0; 2 1.4,0
CAP-PTH-SMALLEZ = drill 0.7 pad 1.651: 1 0,0; 2 2.54,0
DO41-7.6 = drill 1.1 pad 1.7: A 3.81,0; C -3.81,0
2X5-SHROUDED_LOCK = drill 1.016 pad 1.88 octagon: 1 -1.397,5.08; 2 1.397,5.08; 3 -1.397,2.54; 4 1.397,2.54; 5 -1.397,0; 6 1.397,0; 7 -1.397,-2.54; 8 1.397,-2.54; 9 -1.397,-5.08; 10 1.397,-5.08
4,5 = hole 4.5: 0,0
TO263-5 = smd 1.067 x 2.159: 1 -3.404,-5.791; 2 -1.702,-5.791; 3 0,-5.791; 4 1.702,-5.791; 5 3.404,-5.791 | smd 10.8 x 10.41: 6 0,2.54
SOT223 = smd 1.499 x 2.007: 1 -2.261,-3.15; 2 0.025,-3.15; 3 2.311,-3.15 | smd 3.81 x 2.007: 4 0,3.15
USB-A-S = smd 3 x 0.9: D+ 3.45,-1; D- 3.45,1; GND 3.45,-3; VBUS 3.45,3 | drill 2.311: P$5 0,-6.566; P$6 0,6.566
SRU1038 = smd 1.8 x 3.6: 1 -4.5,0; 2 4.5,0
AXIAL-0.3EZ = drill 0.9 pad 1.88: P$1 -3.81,0; P$2 3.81,0
QFN-64 = smd 0.6 x 0.25: 1 -4.5,3.75; 2 -4.5,3.25; 3 -4.5,2.75; 4 -4.5,2.25; 5 -4.5,1.75; 6 -4.5,1.25; 7 -4.5,0.75; 8 -4.5,0.25; 9 -4.5,-0.25; 10 -4.5,-0.75; 11 -4.5,-1.25; 12 -4.5,-1.75; 13 -4.5,-2.25; 14 -4.5,-2.75; 15 -4.5,-3.25; 16 -4.5,-3.75; 33 4.5,-3.75; 34 4.5,-3.25; 35 4.5,-2.75; 36 4.5,-2.25; 37 4.5,-1.75; 38 4.5,-1.25; 39 4.5,-0.75; 40 4.5,-0.25; 41 4.5,0.25; 42 4.5,0.75; 43 4.5,1.25; 44 4.5,1.75; 45 4.5,2.25; 46 4.5,2.75; 47 4.5,3.25; 48 4.5,3.75 | smd 0.25 x 0.6: 17 -3.75,-4.5; 18 -3.25,-4.5; 19 -2.75,-4.5; 20 -2.25,-4.5; 21 -1.75,-4.5; 22 -1.25,-4.5; 23 -0.75,-4.5; 24 -0.25,-4.5; 25 0.25,-4.5; 26 0.75,-4.5; 27 1.25,-4.5; 28 1.75,-4.5; 29 2.25,-4.5; 30 2.75,-4.5; 31 3.25,-4.5; 32 3.75,-4.5; 49 3.75,4.5; 50 3.25,4.5; 51 2.75,4.5; 52 2.25,4.5; 53 1.75,4.5; 54 1.25,4.5; 55 0.75,4.5; 56 0.25,4.5; 57 -0.25,4.5; 58 -0.75,4.5; 59 -1.25,4.5; 60 -1.75,4.5; 61 -2.25,4.5; 62 -2.75,4.5; 63 -3.25,4.5; 64 -3.75,4.5 | smd 7.3 x 7.3: PAD 0,0
J1 = drill 0.9 pad 1.3: 1 4.445,2.54; 2 3.175,0; 3 1.905,2.54; 4 0.635,0; 5 -0.635,2.54; 6 -1.905,0; 7 -3.175,2.54; 8 -4.445,0 | drill 1 pad 1.422: 9 5.465,7.37; 10 2.925,7.37; 11 -2.925,7.37; 12 -5.465,7.37 | drill 1.6 pad 2.184: M1 -7.875,-3.3; M2 7.875,-3.3 | hole 3.3: 5.715,-6.35; -5.715,-6.35
145167-2 = drill 1 pad 1.2: 1 0.254,-1.27; 2 0.254,3.81; 3 1.524,-3.81; 4 1.524,1.27; 5 2.794,-1.27; 6 2.794,3.81; 7 4.064,-3.81; 8 4.064,1.27; 9 5.334,-1.27; 10 5.334,3.81; 11 6.604,-3.81; 12 6.604,1.27; 13 7.874,-1.27; 14 7.874,3.81; 15 9.144,-3.81; 16 9.144,1.27; 17 10.414,-1.27; 18 10.414,3.81; 19 11.684,-3.81; 20 11.684,1.27; 21 12.954,-1.27; 22 12.954,3.81; 23 16.764,-3.81; 24 16.764,1.27; 25 18.034,-1.27; 26 18.034,3.81; 27 19.304,-3.81; 28 19.304,1.27; 29 20.574,-1.27; 30 20.574,3.81; 31 21.844,-3.81; 32 21.844,1.27; 33 23.114,-1.27; 34 23.114,3.81; 35 24.384,-3.81; 36 24.384,1.27; 37 25.654,-1.27; 38 25.654,3.81; 39 26.924,-3.81; 40 26.924,1.27; 41 28.194,-1.27; 42 28.194,3.81; 43 29.464,-3.81; 44 29.464,1.27; 45 30.734,-1.27; 46 30.734,3.81; 47 32.004,-3.81; 48 32.004,1.27; 49 33.274,-1.27; 50 33.274,3.81; 51 34.544,-3.81; 52 34.544,1.27; 53 35.814,-1.27; 54 35.814,3.81; 55 37.084,-3.81; 56 37.084,1.27; 57 38.354,-1.27; 58 38.354,3.81; 59 39.624,-3.81; 60 39.624,1.27; 61 40.894,-1.27; 62 40.894,3.81; 63 42.164,-3.81; 64 42.164,1.27; 65 43.434,-1.27; 66 43.434,3.81; 67 44.704,-3.81; 68 44.704,1.27; 69 45.974,-1.27; 70 45.974,3.81; 71 47.244,-3.81; 72 47.244,1.27; 73 48.514,-1.27; 74 48.514,3.81; 75 49.784,-3.81; 76 49.784,1.27; 77 51.054,-1.27; 78 51.054,3.81; 79 52.324,-3.81; 80 52.324,1.27; 81 53.594,-1.27; 82 53.594,3.81; 83 54.864,-3.81; 84 54.864,1.27; 85 56.134,-1.27; 86 56.134,3.81; 87 57.404,-3.81; 88 57.404,1.27; 89 58.674,-1.27; 90 58.674,3.81; 91 59.944,-3.81; 92 59.944,1.27; 93 61.214,-1.27; 94 61.214,3.81; 95 62.484,-3.81; 96 62.484,1.27; 97 63.754,-1.27; 98 63.754,3.81; 99 65.024,-3.81; 100 65.024,1.27; 101 66.294,-1.27; 102 66.294,3.81; 103 67.564,-3.81; 104 67.564,1.27; 105 68.834,-1.27; 106 68.834,3.81; 107 70.104,-3.81; 108 70.104,1.27; 109 71.374,-1.27; 110 71.374,3.81; 111 72.644,-3.81; 112 72.644,1.27; 113 73.914,-1.27; 114 73.914,3.81; 115 75.184,-3.81; 116 75.184,1.27; 117 76.454,-1.27; 118 76.454,3.81; 119 77.724,-3.81; 120 77.724,1.27 | hole 2.44: 14.854,0; 79.624,0
HC49US = drill 0.7 pad 1.651: 1 -2.54,0; 2 2.54,0

### Placement (x,y rotation side)
C1  33.34,25.72 270 top
C2  16.51,42.55 270 top
C3  14.29,42.55 270 top
C4  14.29,37.47 90 top
C5  16.51,37.47 90 top
C6  134.94,27.62 270 top
C7  132.08,27.62 270 top
C8  129.22,27.62 270 top
C9  126.36,27.62 270 top
C10  123.67,45.56 315 top
C11  127.64,49.53 315 top
C12  121.28,32.7 180 top
C13  125.65,47.55 315 top
C14  143.27,36.51 0 top
C15  139.3,42.23 0 top
C18  113.27,31.11 270 top
C19  115.33,31.11 270 top
C20  111.44,46.04 180 top
D1  33.97,21.27 0 top
EXP1  120,5 270 top
EXP2  120,15 270 top
EXP3  80,5 270 top
EXP4  80,15 270 top
EXP5  37.5,5 270 top
EXP6  37.5,15 270 top
H1  60,10 90 top
H2  140,10 90 top
H3  60,100 90 top
H4  140,100 90 top
H5  15,10 90 top
H6  100,10 90 top
H7  15,100 90 top
H8  100,100 90 top
IC1  10.79,25.72 90 top
IC2  7.94,43.18 90 top
IC3  7.94,36.2 90 top
JP1  34.85,61.59 0 top
L1  24.77,25.72 90 top
R1  136.53,33.97 45 top
R2  134.94,35.88 45 top
R3  133.35,37.47 45 top
R4  131.76,39.05 45 top
R5  153.35,13.18 0 top
R6  123.83,27.94 90 top
R7  134.3,46.99 315 top
R8  108.82,42.47 270 top
R9  143.27,39.05 180 top
U1  117.79,39.05 270 top
X1  147.64,26.67 90 top
X2  150,90 180 top
X3  150,75 180 top
X4  150,60 180 top
Y1  129.22,41.91 225 top

### Tracks (layer width: path | path; a pad name or v marks a point on that pad's centre or on a via)
1.8V
  Top 1.016: C5.1 C4.1 11.09,36.06 IC3.2
3.3V  (via drill 0.35)
  Top 0.254: U1.57 121.7,39.3 | 121.7,39.3 121.7,42.8 | 121.7,42.8 U1.64 122.08,43.02 122.08,45.8 123.83,47.55 C13.1 | U1.54 121.7,37.8 | 121.7,37.8 121.7,39.3 | U1.51 121.7,36.3 | 121.7,36.3 121.7,37.8 | U1.49 121.7,35.3 | 121.7,35.3 121.7,36.3 | U1.10 117.04,42.96 119.54,42.96 | 119.54,42.96 121.7,42.96 121.7,42.8 | U1.5 119.54,42.96 | X1.12 138.22,23.26 125.49,23.26 125.25,23.5 125.25,25.48 122.95,27.78 122.95,30.72 122.4,31.27 122.4,31.59 C12.1 120.54,32.7 U1.46 120.54,35.12 | U1.19 112.34,41.8 111.92,42.23 111.44,42.23 111.12,41.91 111.12,41.35 110.81,41.04 | 110.81,41.04 R8.2 | U1.27 112.55,37.8 112.55,36.83 | 112.55,36.83 112.55,34.05 | 112.55,34.05 114.04,34.05 U1.33 | 112.55,34.05 112.08,34.05 112.08,31.19 117.04,31.19 U1.39 117.04,35.12 120.54,35.12 | 120.54,35.12 121.7,35.12 121.7,35.3 | 110.81,41.04 110.81,37.39 111.2,36.99 112.39,36.99 112.55,36.83
  Top 0.406: C2.1 20.24,43.95 20.24,31.51 26.91,31.51 30.48,27.94 32.31,27.94 32.62,28.26 34.05,28.26 34.45,27.86 46.35,27.86 46.35,1.75 157.16,1.75 R5.P$2 | v147.24,33.26 147.24,39.05 R9.1
  Top 1.016: IC2.2 11.09,43.18 14.29,43.18 C3.1 C2.1
  Bottom 0.406: X1.10 143.9,29.59 144.15,29.84 145.73,29.84 146.37,30.48 146.37,30.8 147,31.43 147.24,31.43 | 147.24,31.43 148.27,31.43 148.91,30.8 148.91,21.59 148.27,20.95 147.32,20.95 | 147.32,20.95 147,20.95 146.37,21.59 140.65,21.59 X1.12 | R5.P$2 152.48,13.18 147,18.65 147,20.64 147.32,20.95 | v147.24,33.26 147.24,31.43
3.3V_CORE
  Top 1.016: EXP6.6 EXP6.5
5V
  Top 1.016: 7.94,38.51 7.94,32.07 19.37,32.07 19.37,27.42 IC1.4 21.97,27.42 L1.2 24.77,30.16 27.94,26.99 C1.+ 45.48,26.99 45.48,0.79 159.23,0.79 159.23,99.93 145.57,100.01 145.57,99.77 arc-46 143.99,96.04 arc-20 141.84,94.61 arc31 X2.15 X2.13 | 7.94,38.51 7.94,45.49 IC2.3 | IC3.3 7.94,38.51 | X4.13 X4.16 X4.14 X4.18 | X4.17 X4.13 | X4.13 X4.15 X3.14 | X3.14 X3.18 | X3.14 X3.16 X3.13 | X3.13 X3.17 | X3.13 X3.15 X2.14 | X2.14 X2.18 | X2.14 X2.16 X2.13 | X2.17 X2.13
  Bottom 1.016: X4.14 142.16,56.19
5V_CORE
  Top 1.016: EXP6.4 EXP6.3
GND  (via drill 0.35)
  Top 0.254: C20.2 110.04,45.22 110.49,44.77 110.49,42.78 110.17,42.47 107.71,42.47
  Top 0.406: R6.P$1 123.75,24.21 123.75,25.96 118.75,30.96 C12.2
  Top 1.016: C1.- 26.04,24.45 24.77,25.72 IC1.3 | C3.2 11.09,41.15 IC2.1 | X2.10 143.75,88.66 X2.12 X2.9 | X3.11 X3.9 | X3.12 X3.10 | X4.12 X4.10 | X4.11 X4.9
  Bottom 1.016: C10.1 127.26,45.56 C13.2 127.64,45.94 C11.1
  other vias: 61.99,20.88 65.64,18.26 49.21,7.7 52.07,4.21 92.23,3.57 106.44,2.78 101.84,18.57 108.82,23.18 132.87,18.97 131.6,4.29 145.65,3.33 150.42,102.16 155.89,106.68 146.53,106.52 14.68,33.42 16.19,33.42 17.7,33.42 14.76,30.64 17.7,30.64 16.19,30.64 137.24,24.84 150.5,24.69 154.07,26.51 152.48,28.65 121.21,30.32 121.44,28.5 111.84,38.26 123.67,35.72 124.54,33.81
  pour Top: 0,109.86 160.02,109.86 160.02,0 0,0 0,50 30,50 30,72 0,72
  pour Bottom: 0,109.86 160.02,109.86 160.02,0 0,0 0,50 30,50 30,72 0,72
GPIO4
  Top 0.254: X2.33 X2.34 X3.33 X3.34 X4.33 X4.34
  Bottom 0.254: EXP1.5 120.02,6.41 120.02,8.97 121.84,10.79 126.21,10.79 127.87,12.46 127.87,18.65 126.05,20.48 122.32,20.48 120.17,22.62 120.17,25.16 109.14,36.2 109.14,44.69 111.12,46.67 113.11,46.67 116.84,50.4 121.6,50.4 125.86,54.66 125.86,55.17 X4.34
GPIO5
  Top 0.254: X2.35 X2.36 X3.35 X3.36 X4.35 X4.36
  Bottom 0.254: EXP1.6 121.21,4.81 121.21,9.6 122,10.4 126.36,10.4 128.27,12.3 128.27,18.81 126.21,20.88 122.48,20.88 120.57,22.78 120.57,25.32 109.54,36.35 109.54,44.53 111.28,46.28 113.27,46.28 117,50.01 121.76,50.01 125.81,54.05 126.6,54.05 128.11,55.56 128.11,56.44 126.92,57.63 126.72,57.63 X4.36
GPIO6
  Top 0.254: X2.37 X2.38 X3.37 X3.38 X4.37 X4.38
  Bottom 0.254: EXP1.7 117.47,6.41 117.47,7.54 121.52,11.59 125.89,11.59 127.08,12.78 127.08,18.34 125.73,19.68 122,19.68 119.38,22.3 119.38,24.84 108.35,35.88 108.35,45.01 110.81,47.47 112.79,47.47 116.52,51.2 121.28,51.2 124.46,54.37 124.46,56.08 X4.38
GPIO7
  Top 0.254: X2.39 X2.40 X3.39 X3.40 X4.39 X4.40
  Bottom 0.254: EXP1.8 118.75,4.89 118.75,8.26 121.68,11.19 126.05,11.19 127.48,12.62 127.48,18.49 125.89,20.08 122.16,20.08 119.78,22.46 119.78,25 108.74,36.04 108.74,44.85 110.97,47.07 112.95,47.07 116.68,50.8 121.44,50.8 125.25,54.61 125.25,55.24 125.57,55.56 125.57,56.44 124.38,57.63 124.18,57.63 X4.40
GPIO8
  Top 0.254: X2.41 X2.42 X3.41 X3.42 X4.41 X4.42
  Bottom 0.254: EXP1.9 120.91,12.38 125.57,12.38 126.29,13.1 126.29,18.02 125.41,18.89 121.68,18.89 118.59,21.99 118.59,24.53 107.55,35.56 107.55,45.32 110.49,48.26 112.47,48.26 116.2,51.99 117.61,51.99 X4.42
GPIO9
  Top 0.254: X2.43 X2.44 X3.43 X3.44 X4.43 X4.44
  Bottom 0.254: EXP1.10 116.13,4.81 116.13,6.91 121.21,11.99 125.73,11.99 126.68,12.94 126.68,18.18 125.57,19.29 121.84,19.29 118.98,22.15 118.98,24.69 107.95,35.72 107.95,45.16 110.65,47.86 112.63,47.86 116.36,51.59 119.14,51.59 123.11,55.56 123.11,56.44 121.92,57.63 121.64,57.63 X4.44
GPIO10
  Top 0.254: X2.45 X2.46 X3.45 X3.46 X4.45 X4.46
  Bottom 0.254: EXP2.1 125.08,17.95 124.54,18.49 121.52,18.49 118.19,21.83 118.19,24.37 107.16,35.4 107.16,45.56 110.25,48.66 112.32,48.66 119.27,55.61 X4.46
GPIO11
  Top 0.254: X2.47 X2.48 X3.47 X3.48 X4.47 X4.48
  Bottom 0.254: EXP2.2 125.08,13.75 123.83,15 123.83,17.46 123.19,18.1 121.36,18.1 117.79,21.67 117.79,24.21 106.76,35.24 106.76,45.8 110.01,49.05 112.16,49.05 118,54.89 X4.48
GPIO12
  Top 0.254: X2.49 X2.50 X3.49 X3.50 X4.49 X4.50
  Bottom 0.254: EXP2.3 122.54,17.32 122.16,17.7 121.21,17.7 117.4,21.51 117.4,24.05 106.36,35.08 106.36,46.04 109.78,49.45 112,49.45 116.73,54.18 X4.50
GPIO13
  Top 0.254: X2.51 X2.52 X3.51 X3.52 X4.51 X4.52
  Bottom 0.254: EXP2.4 122.54,13.75 121.28,15 121.28,17.07 117,21.35 117,23.89 105.97,34.92 105.97,46.2 109.62,49.85 111.84,49.85 115.46,53.46 X4.52
GPIO17
  Top 0.254: X2.57 X2.58 X3.57 X3.58 X4.57 X4.58
  Bottom 0.254: EXP2.7 117.46,19.22 115.81,20.88 115.81,23.42 104.78,34.45 104.78,46.67 111.65,53.54 X4.58
GPIO18
  Top 0.254: X2.59 X2.60 X3.59 X3.60 X4.59 X4.60
  Bottom 0.254: EXP2.8 117.46,13.67 116.2,14.92 116.2,19.92 115.41,20.72 115.41,23.26 104.38,34.29 104.38,46.83 110.38,52.83 X4.60
GPIO19
  Top 0.254: X2.61 X2.62 X3.61 X3.62 X4.61 X4.62
  Bottom 0.254: EXP2.9 114.92,17.21 115.81,18.1 115.81,19.76 115.01,20.56 115.01,23.1 103.98,34.13 103.98,47.07 109.11,52.19 X4.62
GPIO20
  Top 0.254: X2.63 X2.64 X3.63 X3.64 X4.63 X4.64
  Bottom 0.254: EXP2.10 114.92,13.75 113.59,15.08 113.59,16.83 114.38,17.62 114.78,17.62 115.41,18.26 115.41,19.61 114.62,20.4 114.62,22.94 103.58,33.97 103.58,47.23 107.84,51.48 X4.64
GPIO21
  Top 0.254: X2.65 X2.66 X3.65 X3.66 X4.65 X4.66
  Bottom 0.254: X4.66 106.57,55.45 104.06,52.94 99.85,52.94 99.38,52.47 99.38,20.64 87.47,8.73 85.65,8.73 85.08,8.17 EXP3.1
GPIO22
  Top 0.254: X2.67 X2.68 X3.67 X3.68 X4.67 X4.68
  Bottom 0.254: X4.68 105.3,55.61 103.11,53.42 99.69,53.42 98.9,52.63 98.9,20.8 87.23,9.13 84.69,9.13 83.82,8.26 83.82,5.08 85.08,3.82 EXP3.2
GPIO23
  Top 0.254: X2.69 X2.70 X3.69 X3.70 X4.69 X4.70
  Bottom 0.254: X4.70 104.03,55.92 102,53.9 99.46,53.9 98.42,52.86 98.42,20.95 87,9.53 83.42,9.53 82.54,8.64 EXP3.3
GPIO24
  Top 0.254: X2.71 X2.72 X3.71 X3.72 X4.71 X4.72
  Bottom 0.254: X4.72 102.76,55.53 101.6,54.37 99.22,54.37 97.95,53.1 97.95,21.11 86.76,9.92 82.31,9.92 81.28,8.89 81.28,5 82.54,3.74 EXP3.4
GPIO25
  Top 0.254: X2.73 X2.74 X3.73 X3.74 X4.73 X4.74
  Bottom 0.254: X4.74 101.49,55.53 100.73,54.77 98.9,54.77 97.47,53.34 97.47,21.27 86.52,10.32 81.76,10.32 80,8.56 EXP3.5
GPIO26
  Top 0.254: X2.75 X2.76 X3.75 X3.76 X4.75 X4.76
  Bottom 0.254: EXP3.6 78.74,4.86 78.74,8.49 80.96,10.72 86.28,10.72 97,21.43 97,53.5 98.66,55.17 99.54,55.17 100.22,55.84 X4.76
GPIO27
  Top 0.254: X2.77 X2.78 X3.77 X3.78 X4.77 X4.78
  Bottom 0.254: EXP3.7 77.39,6.47 77.39,7.7 80.8,11.11 86.04,11.11 96.52,21.59 96.52,53.74 98.95,56.16 X4.78
GPIO28
  Top 0.254: X2.79 X2.80 X3.79 X3.80 X4.79 X4.80
  Bottom 0.254: EXP3.8 76.2,4.86 76.2,7.22 80.49,11.51 85.8,11.51 96.04,21.75 96.04,54.05 97.68,55.69 X4.80
GPIO29
  Top 0.254: X2.81 X2.82 X3.81 X3.82 X4.81 X4.82
  Bottom 0.254: X4.82 96.41,55.13 95.57,54.29 95.57,21.83 85.65,11.91 79.14,11.91 74.93,7.7 EXP3.9
GPIO30
  Top 0.254: X2.83 X2.84 X3.83 X3.84 X4.83 X4.84
  Bottom 0.254: EXP3.10 73.42,5.1 73.42,8.41 77.31,12.3 85.49,12.3 95.14,21.95 X4.84
GPIO31
  Top 0.254: X2.85 X2.86 X3.85 X3.86 X4.85 X4.86
  Bottom 0.254: EXP4.1 93.87,25.18 X4.86
GPIO32
  Top 0.254: X2.87 X2.88 X3.87 X3.88 X4.87 X4.88
  Bottom 0.254: EXP4.2 83.82,14.86 83.82,16.83 92.6,25.6 X4.88
GPIO33
  Top 0.254: X2.89 X2.90 X3.89 X3.90 X4.89 X4.90
  Bottom 0.254: EXP4.3 91.33,25.18 X4.90
GPIO34
  Top 0.254: X2.91 90.06,91.44 90.09,91.44 90.09,88.73 | 90.09,88.73 X2.92 | 90.09,88.73 90.09,78.81 X3.91 X3.92 X4.91 X4.92
  Bottom 0.254: EXP4.4 81.28,14.86 81.28,16.83 90.06,25.6 X4.92
GPIO35
  Top 0.254: X2.93 X2.94 X3.93 X3.94 X4.93 X4.94
  Bottom 0.254: EXP4.5 88.79,25.18 X4.94
GPIO36
  Top 0.254: X2.95 X2.96 X3.95 X3.96 X4.95 X4.96
  Bottom 0.254: EXP4.6 78.74,14.86 78.74,16.91 87.52,25.68 X4.96
GPIO37
  Top 0.254: X2.97 X2.98 X3.97 86.25,75.72 X3.98 X4.97 X4.98
  Bottom 0.254: EXP4.7 86.25,25.18 X4.98
GPIO38
  Top 0.254: X2.99 X2.100 X3.99 X3.100 X4.99 X4.100
  Bottom 0.254: EXP4.8 76.2,14.86 76.2,16.83 84.98,25.6 X4.100
GPIO39
  Top 0.254: X2.101 X2.102 X3.101 X3.102 X4.101 X4.102
  Bottom 0.254: EXP4.9 83.71,25.18 X4.102
GPIO40
  Top 0.254: X2.103 X2.104 X3.103 X3.104 X4.103 X4.104
  Bottom 0.254: EXP4.10 73.5,15.02 73.5,16.75 82.44,25.68 X4.104
GPIO41
  Top 0.254: X2.105 X2.106 X3.105 X3.106 X4.105 X4.106
  Bottom 0.254: EXP5.1 81.17,44.98 X4.106
GPIO42
  Top 0.254: X2.107 X2.108 X3.107 X3.108 X4.107 X4.108
  Bottom 0.254: EXP5.2 41.35,4.83 41.35,7.14 79.9,45.69 X4.108
GPIO43
  Top 0.254: X2.109 X2.110 X3.109 X3.110 X4.109 X4.110
  Bottom 0.254: EXP5.3 78.63,44.98 X4.110
GPIO44
  Top 0.254: X2.111 X2.112 X3.111 X3.112 X4.111 X4.112
  Bottom 0.254: EXP5.4 38.81,4.83 38.81,7.14 77.36,45.69 X4.112
GPIO45
  Top 0.254: X4.114 X4.113 X3.114 X3.113 X2.114 X2.113
  Bottom 0.254: EXP5.5 76.09,44.98 X4.114
N$1
  Top 0.254: U1.52 124.49,36.8 127.64,33.66 128.27,33.66 130.49,31.43 133.67,31.43 R1.P$1
  Bottom 0.254: R1.P$1 134.78,30.32 134.94,30.16 | 134.94,30.16 137.79,27.3 X1.4 | C6.1 134.94,30.16
N$2
  Top 0.254: U1.53 124.62,37.3 127.64,34.29 128.27,34.29 129.22,33.34 132.08,33.34 R2.P$1 133.82,33.18 139.7,27.3 145.73,27.3 147.64,25.4 X1.6
  Bottom 0.254: R2.P$1 132.08,33.02 C7.1
N$3
  Top 0.254: U1.55 125.21,38.3 126.36,37.15 126.36,36.2 127.64,34.92 130.49,34.92 R3.P$1
  Bottom 0.254: X1.1 144.78,30.8 137.16,30.8 133.35,34.61 130.81,34.61 R3.P$1 129.86,33.97 129.86,28.26 C8.1
N$4
  Top 0.254: U1.56 125.66,38.8 127.95,36.51 128.91,36.51 R4.P$1 131.6,36.36 137.16,30.8 142.88,30.8 X1.3
  Bottom 0.254: R4.P$1 127.95,35.24 127.95,29.21 C9.1
N$7  (via drill 0.35)
  Top 0.254: v111.76,41.51 112.47,40.8 U1.21
  Bottom 0.254: X1.9 136.46,32.13 130.49,38.1 130.49,39.37 128.27,41.59 114.78,41.59 114.14,40.96 112.32,40.96 v111.76,41.51
N$8  (via drill 0.35)
  Top 0.254: U1.22 112.38,40.3 v111.76,39.69
  Bottom 0.254: X1.11 140.09,23.75 137.48,26.35 125.73,26.35 125.09,26.99 125.09,28.26 127,30.16 127,38.42 126.36,39.05 126.36,39.69 125.09,40.96 114.94,40.96 114.3,40.32 112.39,40.32 v111.76,39.69
N$9
  Top 0.254: U1.41 118.04,33.75 117.47,33.18 117.47,31.04 122.56,25.96 122.56,23.57 123.27,22.86 136.84,22.86 138.83,20.88 138.83,20.48 139.3,20 142.72,20 R5.P$1
N$10
  Top 0.254: U1.50 122.95,35.8 122.95,32.46 123.11,32.46 R6.P$2
N$11
  Top 0.254: U1.61 125.57,41.3 | 125.57,41.3 126.24,41.3 Y1.2 | C10.2 125.46,41.41 125.57,41.3
N$12
  Top 0.254: R7.P$1 131.61,47.47 130.81,46.67 130.81,46.35 | 130.81,46.35 130.81,43.91 Y1.1 | C11.2 130.7,46.46 130.81,46.35
N$14
  Top 0.254: U1.60 125.25,40.8 126.36,39.69 126.36,39.05 127,38.42 128.59,38.42 133.67,43.5 136.2,43.5 R7.P$2
RXD0
  Top 0.254: X2.55 X2.56 X3.55 X3.56 X4.55 X4.56
  Bottom 0.254: EXP2.6 120,13.67 118.67,15 118.67,18.57 116.2,21.03 116.2,23.57 105.17,34.61 105.17,46.51 109.3,50.64 111.44,50.64 112.92,52.12 X4.56
SCL
  Top 0.254: X2.27 X2.28 X3.27 X3.28 X4.27 X4.28
  Bottom 0.254: EXP1.2 126.36,4.89 126.36,6.91 125.09,8.18 125.09,8.57 125.33,8.81 127,8.81 129.86,11.67 129.86,19.45 126.84,22.46 123.11,22.46 122.16,23.42 122.16,26.04 111.12,37.07 111.12,43.74 112.08,44.69 113.9,44.69 117.63,48.42 122.4,48.42 126.29,52.31 129.94,52.31 133.19,55.56 133.19,56.52 132,57.71 131.72,57.71 X4.28
SCL1
  Top 0.254: X2.31 X2.32 X3.31 X3.32 X4.31 X4.32
  Bottom 0.254: EXP1.4 123.83,4.89 123.83,6.83 122.95,7.7 122.32,7.7 122,8.02 122,9.29 122.32,9.6 126.68,9.6 129.06,11.99 129.06,19.13 126.52,21.67 122.79,21.67 121.36,23.1 121.36,25.64 110.33,36.67 110.33,44.21 111.6,45.48 113.59,45.48 117.32,49.21 122.08,49.21 126.13,53.26 128.35,53.26 130.65,55.56 130.65,56.44 129.46,57.63 129.26,57.63 X4.32
SDA
  Top 0.254: X2.25 X2.26 X3.25 X3.26 X4.25 X4.26
  Bottom 0.254: EXP1.1 124.7,6.78 124.7,8.81 125.09,9.21 126.84,9.21 129.46,11.83 129.46,19.29 126.68,22.07 122.95,22.07 121.76,23.26 121.76,25.88 110.73,36.91 110.73,43.97 111.84,45.09 113.74,45.09 117.47,48.82 122.24,48.82 126.21,52.78 128.56,52.78 X4.26
SDA1
  Top 0.254: X2.29 X2.30 X3.29 X3.30 X4.29 X4.30
  Bottom 0.254: EXP1.3 121.6,7.33 121.6,9.45 122.16,10 126.52,10 128.67,12.14 128.67,18.97 126.36,21.27 122.63,21.27 120.97,22.94 120.97,25.48 109.93,36.51 109.93,44.37 111.44,45.88 113.43,45.88 117.16,49.61 121.92,49.61 125.97,53.66 126.89,53.66 X4.30
TXD0
  Top 0.254: X2.53 X2.54 X3.53 X3.54 X4.53 X4.54
  Bottom 0.254: EXP2.5 120,17.8 116.6,21.19 116.6,23.73 105.57,34.77 105.57,46.35 109.46,50.24 111.68,50.24 114.19,52.75 X4.54
USB2+
  Top 0.254: U1.2 121.04,45.95 126.52,51.44 156.61,51.44 158.04,52.86 158.04,81.68 153.51,86.2 X2.2 | X2.2 | X2.2 149.38,86.2 148.11,87.47 147.88,87.47 147.24,88.11 147.24,89.53 147.72,90.01 148.49,90.01 X2.1
USB2-
  Top 0.254: U1.1 121.54,45.9 126.6,50.96 156.84,50.96 158.43,52.55 158.43,84.3 153.99,88.74 X2.4
  Bottom 0.254: X2.3 X2.4
USB2_PWR  (via drill 0.35)
  Top 0.254: U1.14 115.04,44.29 v115.2,44.29
  Bottom 0.254: 147.24,87.47 152.56,87.47 158.43,81.6 158.43,52.55 156.84,50.96 126.6,50.96 122.87,47.23 118.11,47.23 117.79,46.91 117.79,45.4 117.24,44.85 115.25,44.85 115.04,44.64 115.04,44.29 115.09,44.29 v115.2,44.29 | 147.24,87.47 147.21,87.44 X2.6 | 147.24,87.47 147.24,91.23 X2.5
USB3+
  Top 0.254: U1.4 120.04,46.06 126.29,52.31 156.21,52.31 157.16,53.26 157.16,67.55 153.51,71.2 X3.2 148.55,72.39 147.96,72.39 147.24,73.1 147.24,74.06 149.45,76.27 X3.1
USB3-
  Top 0.254: U1.3 120.54,46.01 126.36,51.83 156.37,51.83 157.64,53.1 157.64,70.56 154.46,73.74 X3.4
  Bottom 0.254: X3.3 X3.4
USB3_PWR  (via drill 0.35)
  Top 0.254: U1.16 114.04,44.85 111.6,44.85 111.6,47.31 114.06,47.31 114.06,46.43 115.01,45.48 v115.65,45.48
  Bottom 0.254: v115.65,45.48 116.76,45.48 117.4,46.12 117.4,47.07 117.95,47.62 122.71,47.62 126.52,51.44 156.61,51.44 158.04,52.86 158.04,67.79 153.43,72.39 147.24,72.39 147.24,71.22 X3.6 X3.5
USB4+
  Top 0.254: X4.2 146.82,53.26 126.13,53.26 119.06,46.2 119.06,44.61 118.54,44.09 U1.7
  Bottom 0.254: X4.1 X4.2
USB4-
  Top 0.254: X4.3 X4.4 153.43,58.74 156.77,55.4 156.77,53.58 155.89,52.7 126.21,52.78 119.54,46.12 119.54,44.45 119.04,43.95 U1.6
USB4_PWR  (via drill 0.35)
  Top 0.254: U1.17 113.29,44.4 111.2,44.4 111.2,47.7 114.54,47.7 114.54,46.59 114.94,46.2 116.44,46.2 v116.44,46.12 | X4.6 X4.5
  Bottom 0.254: v116.44,46.12 116.44,46.2 117,46.75 117,47.23 117.79,48.02 122.56,48.02 126.36,51.83 147.21,51.83 X4.6
USB5+
  Top 0.254: JP1.D+ 51.88,60.59 62.63,49.85 117,49.85 117.55,49.29 117.55,45.8 117.54,45.79 117.54,45.63 117,45.09 117,44.53 117.55,43.97 117.54,43.96 U1.9
USB5-
  Top 0.254: JP1.D- 50.44,62.59 62.79,50.24 117.24,50.24 118.03,49.45 118.04,46.34 118.04,45.49 117.4,44.85 117.4,44.69 118.03,44.05 U1.8
USB5_PWR  (via drill 0.35)
  Top 0.254: JP1.VBUS 48.99,64.59 62.94,50.64 117.47,50.64 118.51,49.61 118.51,44.77 v118.27,44.77 | v111.76,43.02 112.47,42.31 U1.18
  Bottom 0.254: v118.27,44.77 118.35,44.77 118.35,42.86 117.79,42.31 112.47,42.31 v111.76,43.02
USB+  (via drill 0.35)
  Top 0.254: U1.59 124.8,40.3 v125.57,39.53
  Bottom 0.254: EXP5.10 34.44,1.59 147.48,1.59 147.48,11.83 138.83,20.48 138.83,20.88 136.84,22.86 123.27,22.86 122.56,23.57 122.56,25.64 123.75,26.83 123.75,29.13 125.33,30.72 125.33,35.96 124.06,37.23 124.06,39.93 124.46,40.32 124.78,40.32 v125.57,39.53
USB-  (via drill 0.35)
  Top 0.254: U1.58 124.34,39.8 v124.7,39.45
  Bottom 0.254: EXP5.9 32.42,5.35 31.19,4.13 31.19,3.1 31.91,2.38 33.1,2.38 34.29,1.19 147.88,1.19 147.88,11.99 139.22,20.64 139.22,21.03 137,23.26 125.49,23.26 125.25,23.5 125.25,26.27 124.46,27.07 124.46,29.21 125.73,30.48 125.73,36.2 124.7,37.23 v124.7,39.45
V+
  Top 1.016: EXP6.10 EXP6.9 32.42,16.79 | 32.42,16.79 29.84,19.37 22.54,19.37 21.91,20 21.91,21.59 21.18,22.31 IC1.1 | X2.22 X2.20 X2.21 X2.19 X2.23 133.24,109.06 0.95,109.06 0.95,72.95 30.96,72.95 30.96,49.13 1.03,49.13 1.03,16.79 32.42,16.79 | X2.22 X3.19 | X3.19 X3.21 X3.20 X3.22 | X4.19 X4.21 X4.20 X4.22 X4.24 | X4.19 X3.22 | X4.23 X4.19 | X3.24 X3.22 | X3.23 X3.19 | X2.24 X2.22
VBUS_DET
  Top 0.254: U1.11 116.54,45.26 117.08,45.8 117.08,46.51 115.49,48.1 109.7,48.1 108.82,47.23 R8.1
VDD18CORE
  Top 0.254: C20.1 113.27,45.56 113.51,45.32 114.54,45.32 U1.15 114.54,42.96 113.85,42.96 113.85,35.12 116.54,35.12 U1.38 116.54,32.52 C19.1 C18.1
VDDA33
  Top 0.406: R1.P$2 139.22,36.51 C14.1 R9.2 141.87,39.42 | C15.1 134.46,42.23 R4.P$2
  Top 1.016: R1.P$2 R2.P$2 R3.P$2 R4.P$2
VOUT
  Top 1.016: IC1.2 21.97,24.02 L1.1 24.77,21.27 D1.C

### Text on the board
tPlace: REAR